# EasyEDA Pro project Boxi.eprj

# Schematic Light Controller
Board Name: Light Controller; Create Date: 2025-05-13; Page Name: P1; Project Name: Boxi; Schematic Name: Light Controller; Update Date: 2025-05-31; Company: Creme & Foxpaw; Page Size: A4; Version: V1.0
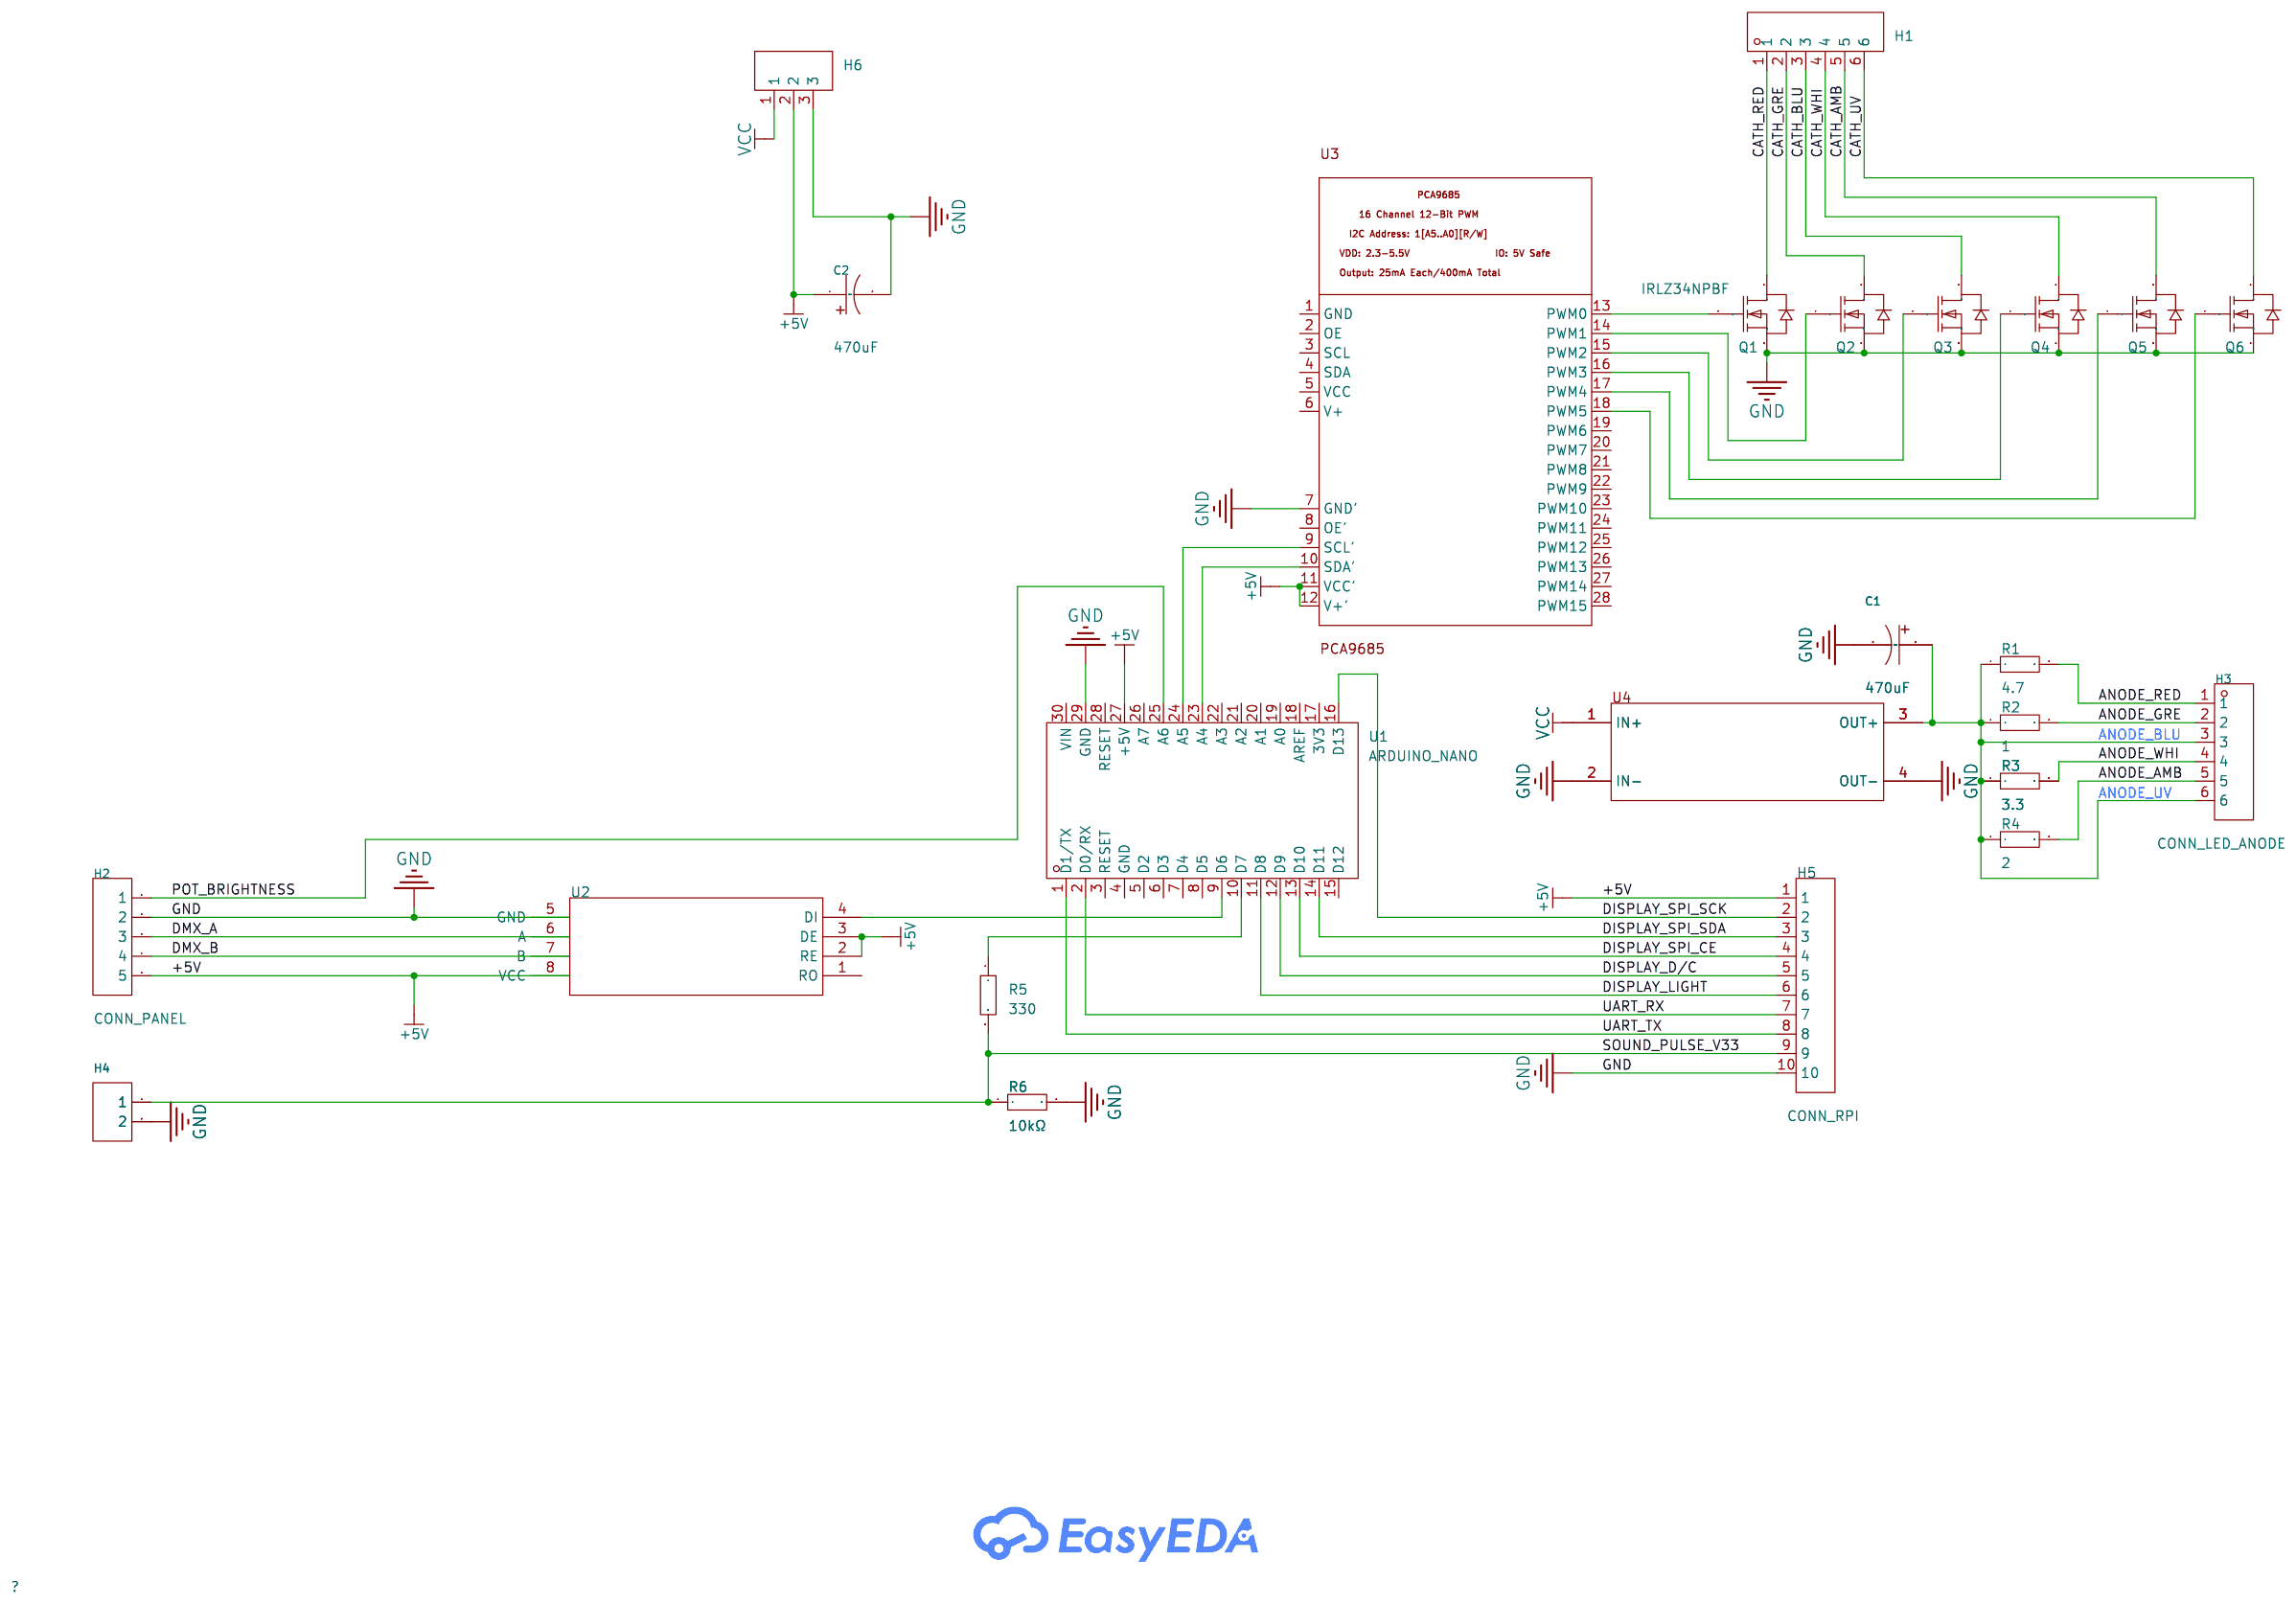
[diagram p0: schematic sheet]

## Parts
C1  470uF  [CAP-TH_BD13.0-P5.00-D0.6-FD]
C2  470uF  [CAP-TH_BD13.0-P5.00-D0.6-FD]
CONN_LED_CATHODE  H1  [HDR-TH_6P-P2.54-V-F]
H2  CONN_PANEL  [HDR-TH_5P-P2.54-V-F]
H3  CONN_LED_ANODE  [HDR-TH_6P-P2.54-V-F]
H4  -  [HDR-TH_2P-P2.54-V-F]
H5  CONN_RPI  [HDR-TH_10P-P2.54-V-F]
H6  -  [HDR-TH_3P-P2.54-V-F]
Q1  IRLZ34NPBF  [TO-220-3_L10.0-W4.5-P2.54-T]
Q2  IRLZ34NPBF  [TO-220-3_L10.0-W4.5-P2.54-T]
Q3  IRLZ34NPBF  [TO-220-3_L10.0-W4.5-P2.54-T]
Q4  IRLZ34NPBF  [TO-220-3_L10.0-W4.5-P2.54-T]
Q5  IRLZ34NPBF  [TO-220-3_L10.0-W4.5-P2.54-T]
Q6  IRLZ34NPBF  [TO-220-3_L10.0-W4.5-P2.54-T]
R1  4.7  [RES-TH_BD5.0-L15.5-P19.50-D0.8]
R2  1  [RES-TH_BD5.0-L15.5-P19.50-D0.8]
R3  3.3  [RES-TH_BD5.0-L15.5-P19.50-D0.8]
R4  2  [RES-TH_BD5.0-L15.5-P19.50-D0.8]
R5  330  [R_AXIAL-0.4]
R6  10kΩ  [R_AXIAL-0.4]
U1  ARDUINO_NANO  [COMM-TH_ARDUINO_NANO]
U2  -  [MAX485]
U5  -  [PCA9685 MINI]
U6  -  [BuckBoost]

## Library data of the parts
C1 C2 = TKR471M1JJ21M: LCSC Part Name: 470uF ±20% 63V; Supplier Part: C5137684; Manufacturer: JAMICON(凯美); Supplier Footprint: 插件,D13xL21mm; JLCPCB Part Class: Extended Part; Supplier: LCSC; Tolerance: ±20%
CONN_LED_CATHODE H3 = HDR-F_2.54_1x6P: Supplier Footprint: Through
H2 = HDR-F_2.54_1x5P: Supplier Footprint: Through
H4 = HDR-F_2.54_1x2P: Supplier Footprint: Through
H5 = HDR-F_2.54_1x10P: Supplier Footprint: Through
H6 = HDR-F_2.54_1x3P: Supplier Footprint: Through
Q1-Q6 = IRLZ34NPBF: LCSC Part Name: N沟道 耐压:55V 电流:30A; Supplier Part: C11728; Supplier Footprint: TO-220-3; JLCPCB Part Class: Extended Part; Supplier: LCSC; Drain Source On Resistance (RDS(on)@Vgs,Id): 35mΩ@10V,16A
R1-R4 = Res_AXIAL-3W: Supplier Footprint: Through
R5 R6 = Res_AXIAL-1/4W: Supplier Footprint: Through
U1 = ARDUINO_NANO: Supplier Part: C9900017879; Supplier Footprint: 插件; JLCPCB Part Class: Extended Part; Supplier: LCSC
U2 = MAX485 Board
U5 = PCA9685 MINI
U6 = BuckBoost

## Nets
+5V: C2.1 H2.5 H5.1 H6.2 U1.27(+5V) U2.2(RE) U2.3(DE) U2.8(VCC) U5.11(VCC') U5.12(V+')
GND: C1.2 C2.2 H2.2 H4.2 H5.10 H6.3 Q1.3(S) Q2.3(S) Q3.3(S) Q4.3(S) Q5.3(S) Q6.3(S) R6.2 U1.29(GND) U2.5(GND) U5.7(GND') U6.2(IN-) U6.4(OUT-)
VCC: H6.1 U6.1(IN+)
ANODE_AMB: H3.5 R4.2
ANODE_GRE: H3.2 R2.2
ANODE_RED: H3.1 R1.2
ANODE_WHI: H3.4 R3.2
CATH_AMB: CONN_LED_CATHODE.5 Q5.2(D)
CATH_BLU: CONN_LED_CATHODE.3 Q3.2(D)
CATH_GRE: CONN_LED_CATHODE.2 Q2.2(D)
CATH_RED: CONN_LED_CATHODE.1 Q1.2(D)
CATH_UV: CONN_LED_CATHODE.6 Q6.2(D)
CATH_WHI: CONN_LED_CATHODE.4 Q4.2(D)
DISPLAY_D/C: H5.5 U1.12(D9)
DISPLAY_LIGHT: H5.6 U1.11(D8)
DISPLAY_SPI_CE: H5.4 U1.13(D10)
DISPLAY_SPI_SCK: H5.2 U1.16(D13)
DISPLAY_SPI_SDA: H5.3 U1.14(D11)
DMX_A: H2.3 U2.6(A)
DMX_B: H2.4 U2.7(B)
POT_BRIGHTNESS: H2.1 U1.25(A6)
SOUND_PULSE_V33: H4.1 H5.9 R5.2 R6.1
UART_RX: H5.7 U1.2(D0/RX)
UART_TX: H5.8 U1.1(D1/TX)
$1N749: U1.23(A4) U5.10(SDA')
$1N754: U1.24(A5) U5.9(SCL')
$1N1179: R5.1 U1.10(D7)
$1N2604: Q2.1(G) U5.14(PWM1)
$1N2614: Q3.1(G) U5.15(PWM2)
$1N3870: C1.1 H3.3 H3.6 R1.1 R2.1 R3.1 R4.1 U6.3(OUT+)
$1N7627: U1.9(D6) U2.4(DI)
$1N9113: Q6.1(G) U5.18(PWM5)
$1N9120: Q5.1(G) U5.17(PWM4)
$1N9127: Q4.1(G) U5.16(PWM3)
$1N9131: Q1.1(G) U5.13(PWM0)

Not connected (* = marked no-connect by the designer): U1 3(RESET) 4(GND) 5(D2) 6(D3) 7(D4) 8(D5) 15(D12) 17(3V3) 18(AREF) 19(A0) 20(A1) 21(A2) 22(A3) 26(A7) 28(RESET) 30(VIN); U2 1(RO); U5 1(GND) 2(OE) 3(SCL) 4(SDA) 5(VCC) 6(V+) 8(OE') 19(PWM6) 20(PWM7) 21(PWM8) 22(PWM9) 23(PWM10) 24(PWM11) 25(PWM12) 26(PWM13) 27(PWM14) 28(PWM15)

## Notes on the sheet
- ANODE_BLU
- ANODE_UV

# Schematic Pi Hat
Board Name: Pi Hat; Create Date: 2025-05-13; Page Name: P1; Project Name: Boxi; Schematic Name: Pi Hat; Update Date: 2025-05-31; Company: Creme & Foxpaw; Page Size: A4; Version: V1.0
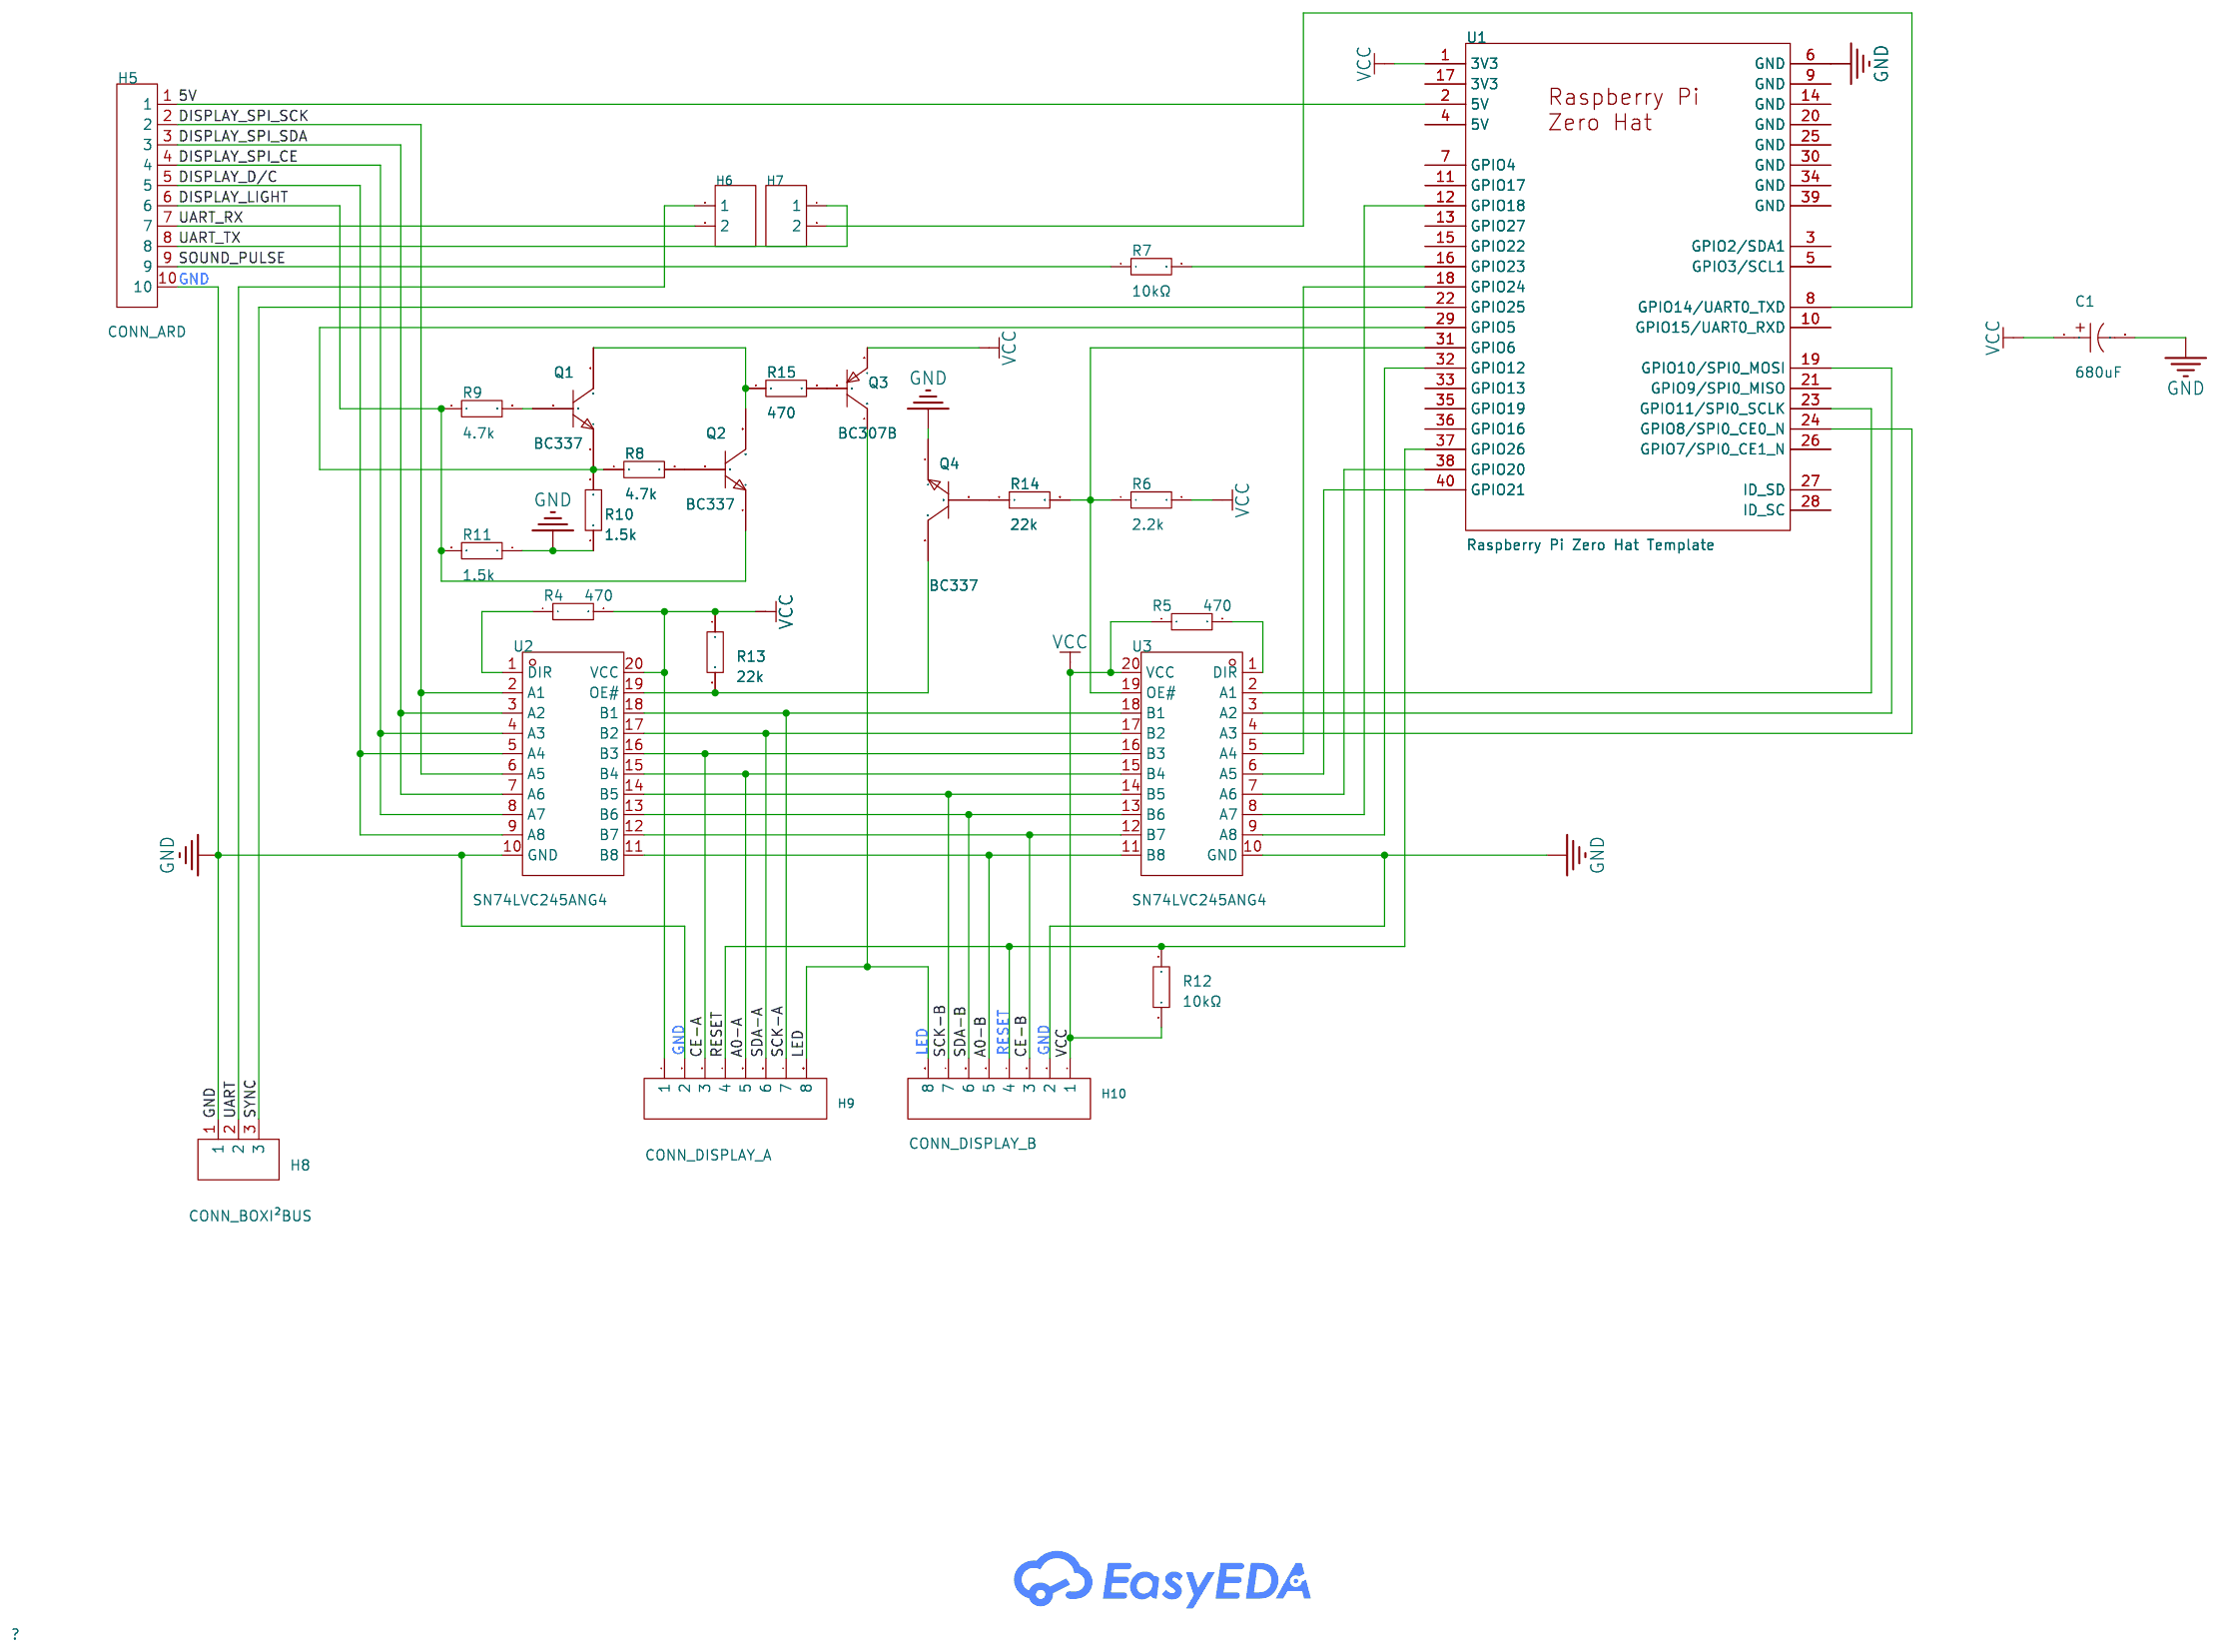
[diagram p1: schematic sheet]

## Parts
C1  680uF  [CAP-TH_BD8.0-P3.50-D0.6-FD_1]
H5  CONN_ARD  [HDR-TH_10P-P2.54-V-F]
H6  -  [HDR-TH_2P-P2.54-V-F]
H7  -  [HDR-TH_2P-P2.54-V-F]
H8  CONN_BOXI²BUS  [HDR-TH_3P-P2.54-V-F]
H9  CONN_DISPLAY_A  [HDR-TH_8P-P2.54-V-F-1]
H10  CONN_DISPLAY_B  [HDR-TH_8P-P2.54-V-F-1]
Q1  BC337  [TO-92-3_L4.8-W3.7-P2.54-R]
Q2  BC337  [TO-92-3_L4.8-W3.7-P2.54-R]
Q3  BC307B  [TO-92-3_L4.8-W3.7-P1.27-L-1]
Q4  BC337  [TO-92-3_L4.8-W3.7-P2.54-R]
R4  470  [R_AXIAL-0.4]
R5  470  [R_AXIAL-0.4]
R6  2.2k  [R_AXIAL-0.4]
R7  10kΩ  [R_AXIAL-0.4]
R8  4.7k  [R_AXIAL-0.4]
R9  4.7k  [R_AXIAL-0.4]
R10  1.5k  [R_AXIAL-0.4]
R11  1.5k  [R_AXIAL-0.4]
R12  10kΩ  [R_AXIAL-0.4]
R13  22k  [R_AXIAL-0.4]
R14  22k  [R_AXIAL-0.4]
R15  470  [R_AXIAL-0.4]
U1  Raspberry Pi Zero Hat Template  [RASPBERRY_PI_ZERO_HAT]
U2  SN74LVC245ANG4  [PDIP-20_L25.9-W6.6-P2.54-LS7.9-BL]
U3  SN74LVC245ANG4  [PDIP-20_L25.9-W6.6-P2.54-LS7.9-BL]

## Library data of the parts
C1 = ESK687M1EF16CB: LCSC Part Name: 680uF ±20% 25V; Supplier Part: C2691538; Manufacturer: MAN YUE(万裕科技); Supplier Footprint: 插件,D8xL16mm; JLCPCB Part Class: Extended Part; Datasheet: https://atta.szlcsc.com/upload/public/pdf/source/20190724/C406799_CDF11B2185D3B9C175922EABD678815E.pdf; Supplier: LCSC; Tolerance: ±20%; Voltage Rating: 25V; Pin Spacing: 3.5mm; Diameter: 8mm; Height - Seated (Max): 16mm; Lifetime: 9000hrs@105℃; Operating Temperature: -45℃~+105℃
H5 = HDR-F_2.54_1x10P: Supplier Footprint: Through
H6 H7 = HDR-F_2.54_1x2P: Supplier Footprint: Through
H8 = HDR-F_2.54_1x3P: Supplier Footprint: Through
H9 H10 = HDR-F_2.54_1x8P: Supplier Footprint: Through
Q1 Q2 Q4 = BC337: LCSC Part Name: 25(160-400); Supplier Part: C328602; Manufacturer: BLUE ROCKET(蓝箭); Supplier Footprint: TO-92-3; JLCPCB Part Class: Extended Part; Datasheet: https://atta.szlcsc.com/upload/public/pdf/source/20181114/C328602_2BE2B884E7C282175BCFE1345E8CDD23.pdf; Supplier: LCSC; type: NPN; Current - Collector(Ic): 800mA; Pd - Power Dissipation: 625mW; DC Current Gain: 100@100mA,1V; Transition frequency(fT): 100MHz; Current - Collector Cutoff: 100nA; Vce Saturation(VCE(sat)): 700mV
Q3 = BC307B: Supplier Part: C3201842; Manufacturer: onsemi(安森美); Supplier Footprint: TO-92-3; JLCPCB Part Class: Extended Part; Datasheet: https://atta.szlcsc.com/upload/public/pdf/source/20230915/AD93F1D629FAD82B19559B4DCC94CDC5.pdf; Supplier: LCSC; type: PNP; DC Current Gain: 180@2mA,5V; Transition frequency(fT): 130MHz; Current - Collector Cutoff: 15nA; Vce Saturation(VCE(sat)): 300mV@10mA,500uA
R4-R15 = Res_AXIAL-1/4W: Supplier Footprint: Through
U1 = Raspberry Pi Zero Hat Template: Manufacturer: Raspberry Pi Foundation
U2 U3 = SN74LVC245ANG4: Supplier Part: C1548982; Manufacturer: TI(德州仪器); Supplier Footprint: PDIP-20; JLCPCB Part Class: Extended Part; Datasheet: https://www.ti.com/cn/lit/gpn/sn74lvc245a; Supplier: LCSC

## Nets
5V: H5.1 U1.2(5V)
GND: C1.2 H5.10 H8.1 H9.2 H10.2 Q4.1(E) R10.1 R11.1 U1.6(GND) U2.10(GND) U3.10(GND)
VCC: C1.1 H9.1 H10.1 Q3.3(E) R4.2 R5.1 R6.2 R12.2 R13.1 U1.1(3V3) U2.20(VCC) U3.20(VCC)
A0-A: H9.5 U2.15(B4) U3.15(B4)
A0-B: H10.5 U2.11(B8) U3.11(B8)
CE-A: H9.3 U2.16(B3) U3.16(B3)
CE-B: H10.3 U2.12(B7) U3.12(B7)
DISPLAY_D/C: H5.5 U2.5(A4) U2.9(A8)
DISPLAY_LIGHT: H5.6 Q2.1(E) R9.1 R11.2
DISPLAY_SPI_CE: H5.4 U2.4(A3) U2.8(A7)
DISPLAY_SPI_SCK: H5.2 U2.2(A1) U2.6(A5)
DISPLAY_SPI_SDA: H5.3 U2.3(A2) U2.7(A6)
LED: H9.8 H10.8 Q3.1(C)
RESET: H9.4 H10.4 R12.1 U1.37(GPIO26)
SCK-A: H9.7 U2.18(B1) U3.18(B1)
SCK-B: H10.7 U2.14(B5) U3.14(B5)
SDA-A: H9.6 U2.17(B2) U3.17(B2)
SDA-B: H10.6 U2.13(B6) U3.13(B6)
SOUND_PULSE: H5.9 R7.1
SYNC: H8.3 U1.22(GPIO25)
UART: H6.1 H8.2
UART_RX: H5.7 H6.2
UART_TX: H5.8 H7.1
$1N1683: U1.23(GPIO11/SPI0_SCLK) U3.2(A1)
$1N1689: U1.19(GPIO10/SPI0_MOSI) U3.3(A2)
$1N1695: U1.24(GPIO8/SPI0_CE0_N) U3.4(A3)
$1N1701: U1.18(GPIO24) U3.5(A4)
$1N1733: U1.40(GPIO21) U3.6(A5)
$1N1755: U1.38(GPIO20) U3.7(A6)
$1N1761: U1.12(GPIO18) U3.8(A7)
$1N1789: U1.32(GPIO12) U3.9(A8)
$1N1944: R4.1 U2.1(DIR)
$1N1977: R5.2 U3.1(DIR)
$1N2168: R6.1 R14.2 U1.31(GPIO6) U3.19(OE#)
$1N2174: Q4.3(C) R13.2 U2.19(OE#)
$1N2477: H7.2 U1.8(GPIO14/UART0_TXD)
$1N2537: R7.2 U1.16(GPIO23)
$1N3217: Q1.3(C) Q2.3(C) R15.1
$1N3257: Q1.1(E) R8.1 R10.2 U1.29(GPIO5)
$1N3259: Q2.2(B) R8.2
$1N3309: Q1.2(B) R9.2
$1N5387: Q4.2(B) R14.1
$1N5983: Q3.2(B) R15.2

Not connected (* = marked no-connect by the designer): U1 3(GPIO2/SDA1) 4(5V) 5(GPIO3/SCL1) 7(GPIO4) 9(GND) 10(GPIO15/UART0_RXD) 11(GPIO17) 13(GPIO27) 14(GND) 15(GPIO22) 17(3V3) 20(GND) 21(GPIO9/SPI0_MISO) 25(GND) 26(GPIO7/SPI0_CE1_N) 27(ID_SD) 28(ID_SC) 30(GND) 33(GPIO13) 34(GND) 35(GPIO19) 36(GPIO16) 39(GND)

## Notes on the sheet
- GND
- GND
- LED
- RESET
- GND

# Schematic Audio Mixer
Board Name: Audio Mixer; Create Date: 2025-05-19; Page Name: P1; Project Name: Boxi; Schematic Name: Audio Mixer; Update Date: 2025-05-19; Company: Creme & Foxpaw; Page Size: A4; Version: V1.0
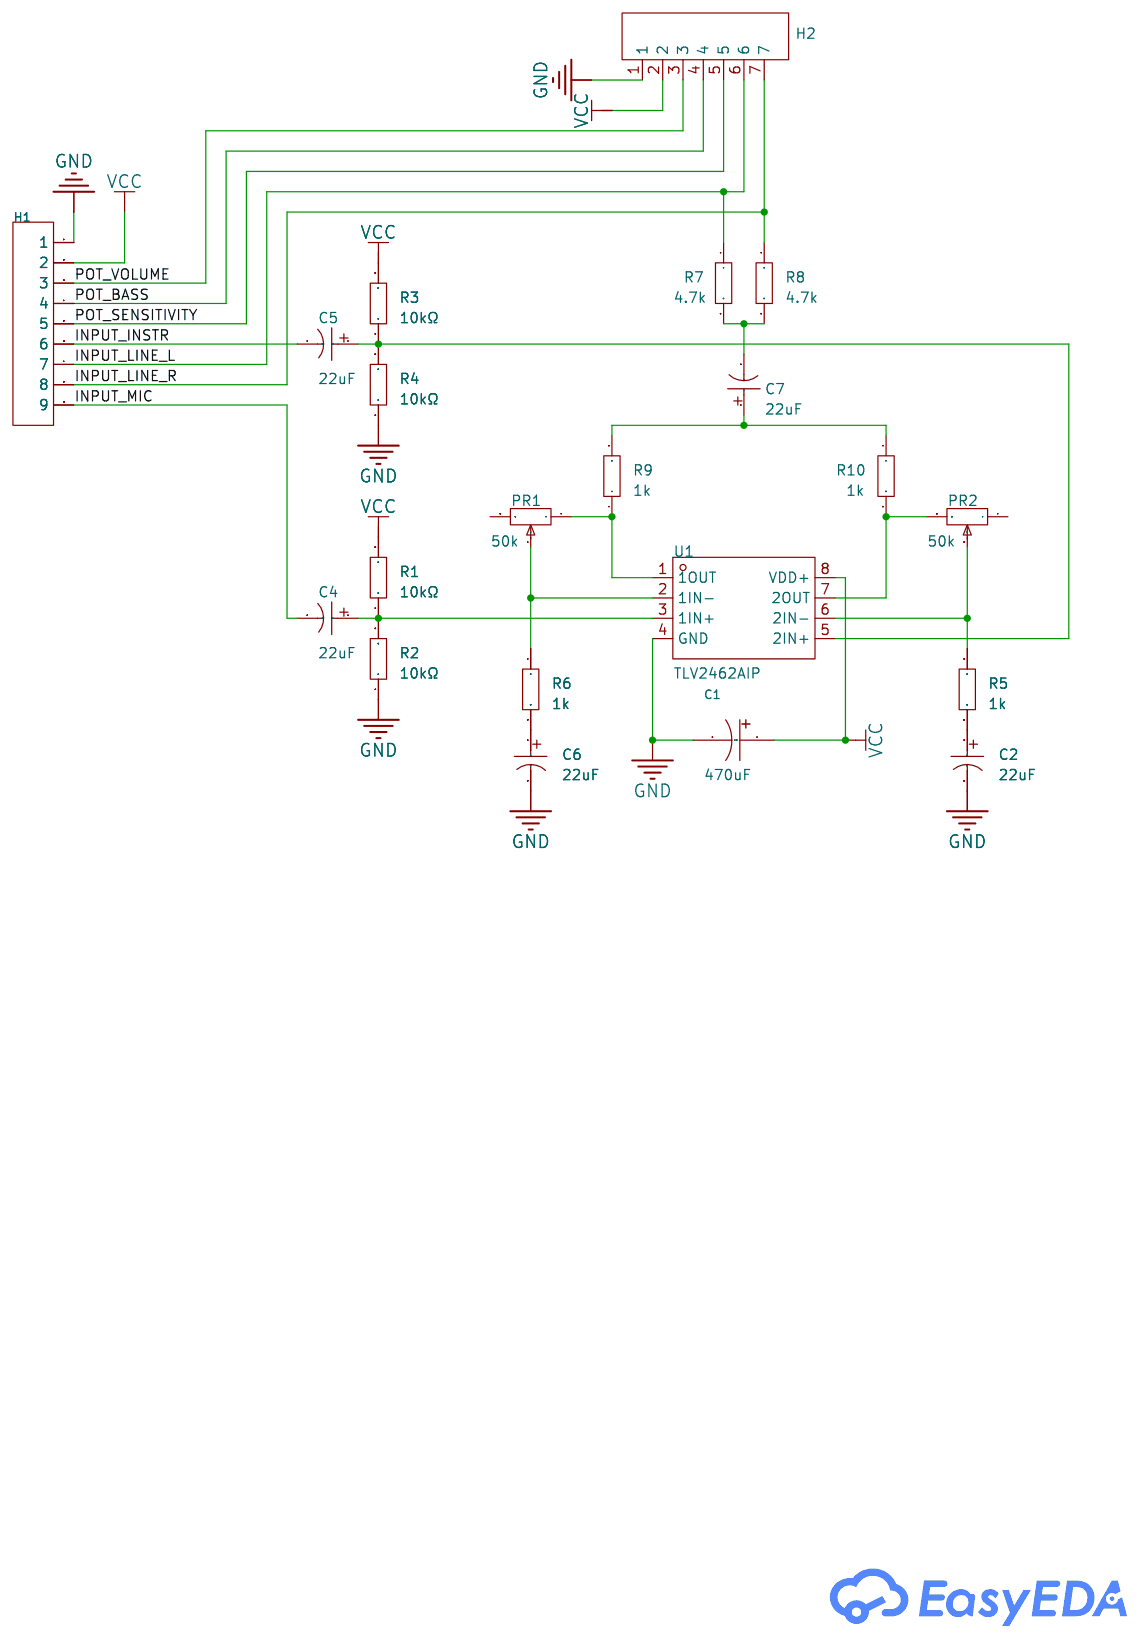
[diagram p2: schematic sheet]

## Parts
C1  470uF  [CAP-TH_BD13.0-P5.00-D0.6-FD]
C2  22uF  [CAP-TH_BD6.3-P2.50-D1.0-FD]
C4  22uF  [CAP-TH_BD6.3-P2.50-D1.0-FD]
C5  22uF  [CAP-TH_BD6.3-P2.50-D1.0-FD]
C6  22uF  [CAP-TH_BD6.3-P2.50-D1.0-FD]
C7  22uF  [CAP-TH_BD6.3-P2.50-D1.0-FD]
H1  -  [HDR-TH_9P-P2.54-V-F-1]
H2  -  [HDR-TH_7P-P2.54-V-F]
PR1  50k  [RES-ADJ-TH_3P-L10.0-W10.0-P2.50-L]
PR2  50k  [RES-ADJ-TH_3P-L10.0-W10.0-P2.50-L]
R1  10kΩ  [R_AXIAL-0.4]
R2  10kΩ  [R_AXIAL-0.4]
R3  10kΩ  [R_AXIAL-0.4]
R4  10kΩ  [R_AXIAL-0.4]
R5  1k  [R_AXIAL-0.4]
R6  1k  [R_AXIAL-0.4]
R7  4.7k  [R_AXIAL-0.4]
R8  4.7k  [R_AXIAL-0.4]
R9  1k  [R_AXIAL-0.4]
R10  1k  [R_AXIAL-0.4]
U1  TLV2462AIP  [PDIP-8_L9.6-W6.4-P2.54-LS7.9-BL]

## Library data of the parts
C1 = TKR471M1JJ21M: LCSC Part Name: 470uF ±20% 63V; Supplier Part: C5137684; Manufacturer: JAMICON(凯美); Supplier Footprint: 插件,D13xL21mm; JLCPCB Part Class: Extended Part; Supplier: LCSC; Tolerance: ±20%
C2 C4-C7 = 470uF 10V 6.3*7: LCSC Part Name: 470uF 10V; Supplier Part: C43325; Supplier Footprint: 插件,6.3x7mm; JLCPCB Part Class: Extended Part; Supplier: LCSC
H1 = HDR-F_2.54_1x9P: Supplier Footprint: Through
H2 = HDR-F_2.54_1x7P: Supplier Footprint: Through
PR1 PR2 = R_3296: Supplier Footprint: Through
R1-R10 = Res_AXIAL-1/4W: Supplier Footprint: Through
U1 = TLV2462AIP: Supplier Part: C1348187; Manufacturer: TI(德州仪器); Supplier Footprint: PDIP-8; JLCPCB Part Class: Extended Part; Datasheet: https://www.ti.com/cn/lit/gpn/tlv2464; Supplier: LCSC; Number of Circuits: Dual; Gain Bandwidth Product(GBP): 6.4MHz; Slew Rate(SR): 1.6V/us; Current - Input Bias(Ib): 1.3nA; Output Current: 80mA; Operating Temperature: -40℃~+125℃

## Nets
GND: C1.2 C2.2 C6.2 H1.1 H2.1 R2.1 R4.1 U1.4(GND)
VCC: C1.1 H1.2 H2.2 R1.2 R3.2 U1.8(VDD+)
INPUT_INSTR: C5.2 H1.6
INPUT_LINE_L: H1.7 H2.6 R7.1
INPUT_LINE_R: H1.8 H2.7 R8.1
INPUT_MIC: C4.2 H1.9
POT_BASS: H1.4 H2.4
POT_SENSITIVITY: H1.5 H2.5
POT_VOLUME: H1.3 H2.3
$1N770: C4.1 R1.1 R2.2 U1.3(1IN+)
$1N1061: PR2.3 R10.2 U1.7(2OUT)
$1N1293: C5.1 R3.1 R4.2 U1.5(2IN+)
$1N1394: C2.1 R5.2
$1N1446: C6.1 R6.2
$1N1450: PR1.2 R6.1 U1.2(1IN-)
$1N1454: PR2.2 R5.1 U1.6(2IN-)
$1N1584: PR1.1 R9.1 U1.1(1OUT)
$1N2116: C7.2 R7.2 R8.2
$1N2130: C7.1 R9.2 R10.1

Not connected (* = marked no-connect by the designer): PR1 3; PR2 1

# Board Light Controller
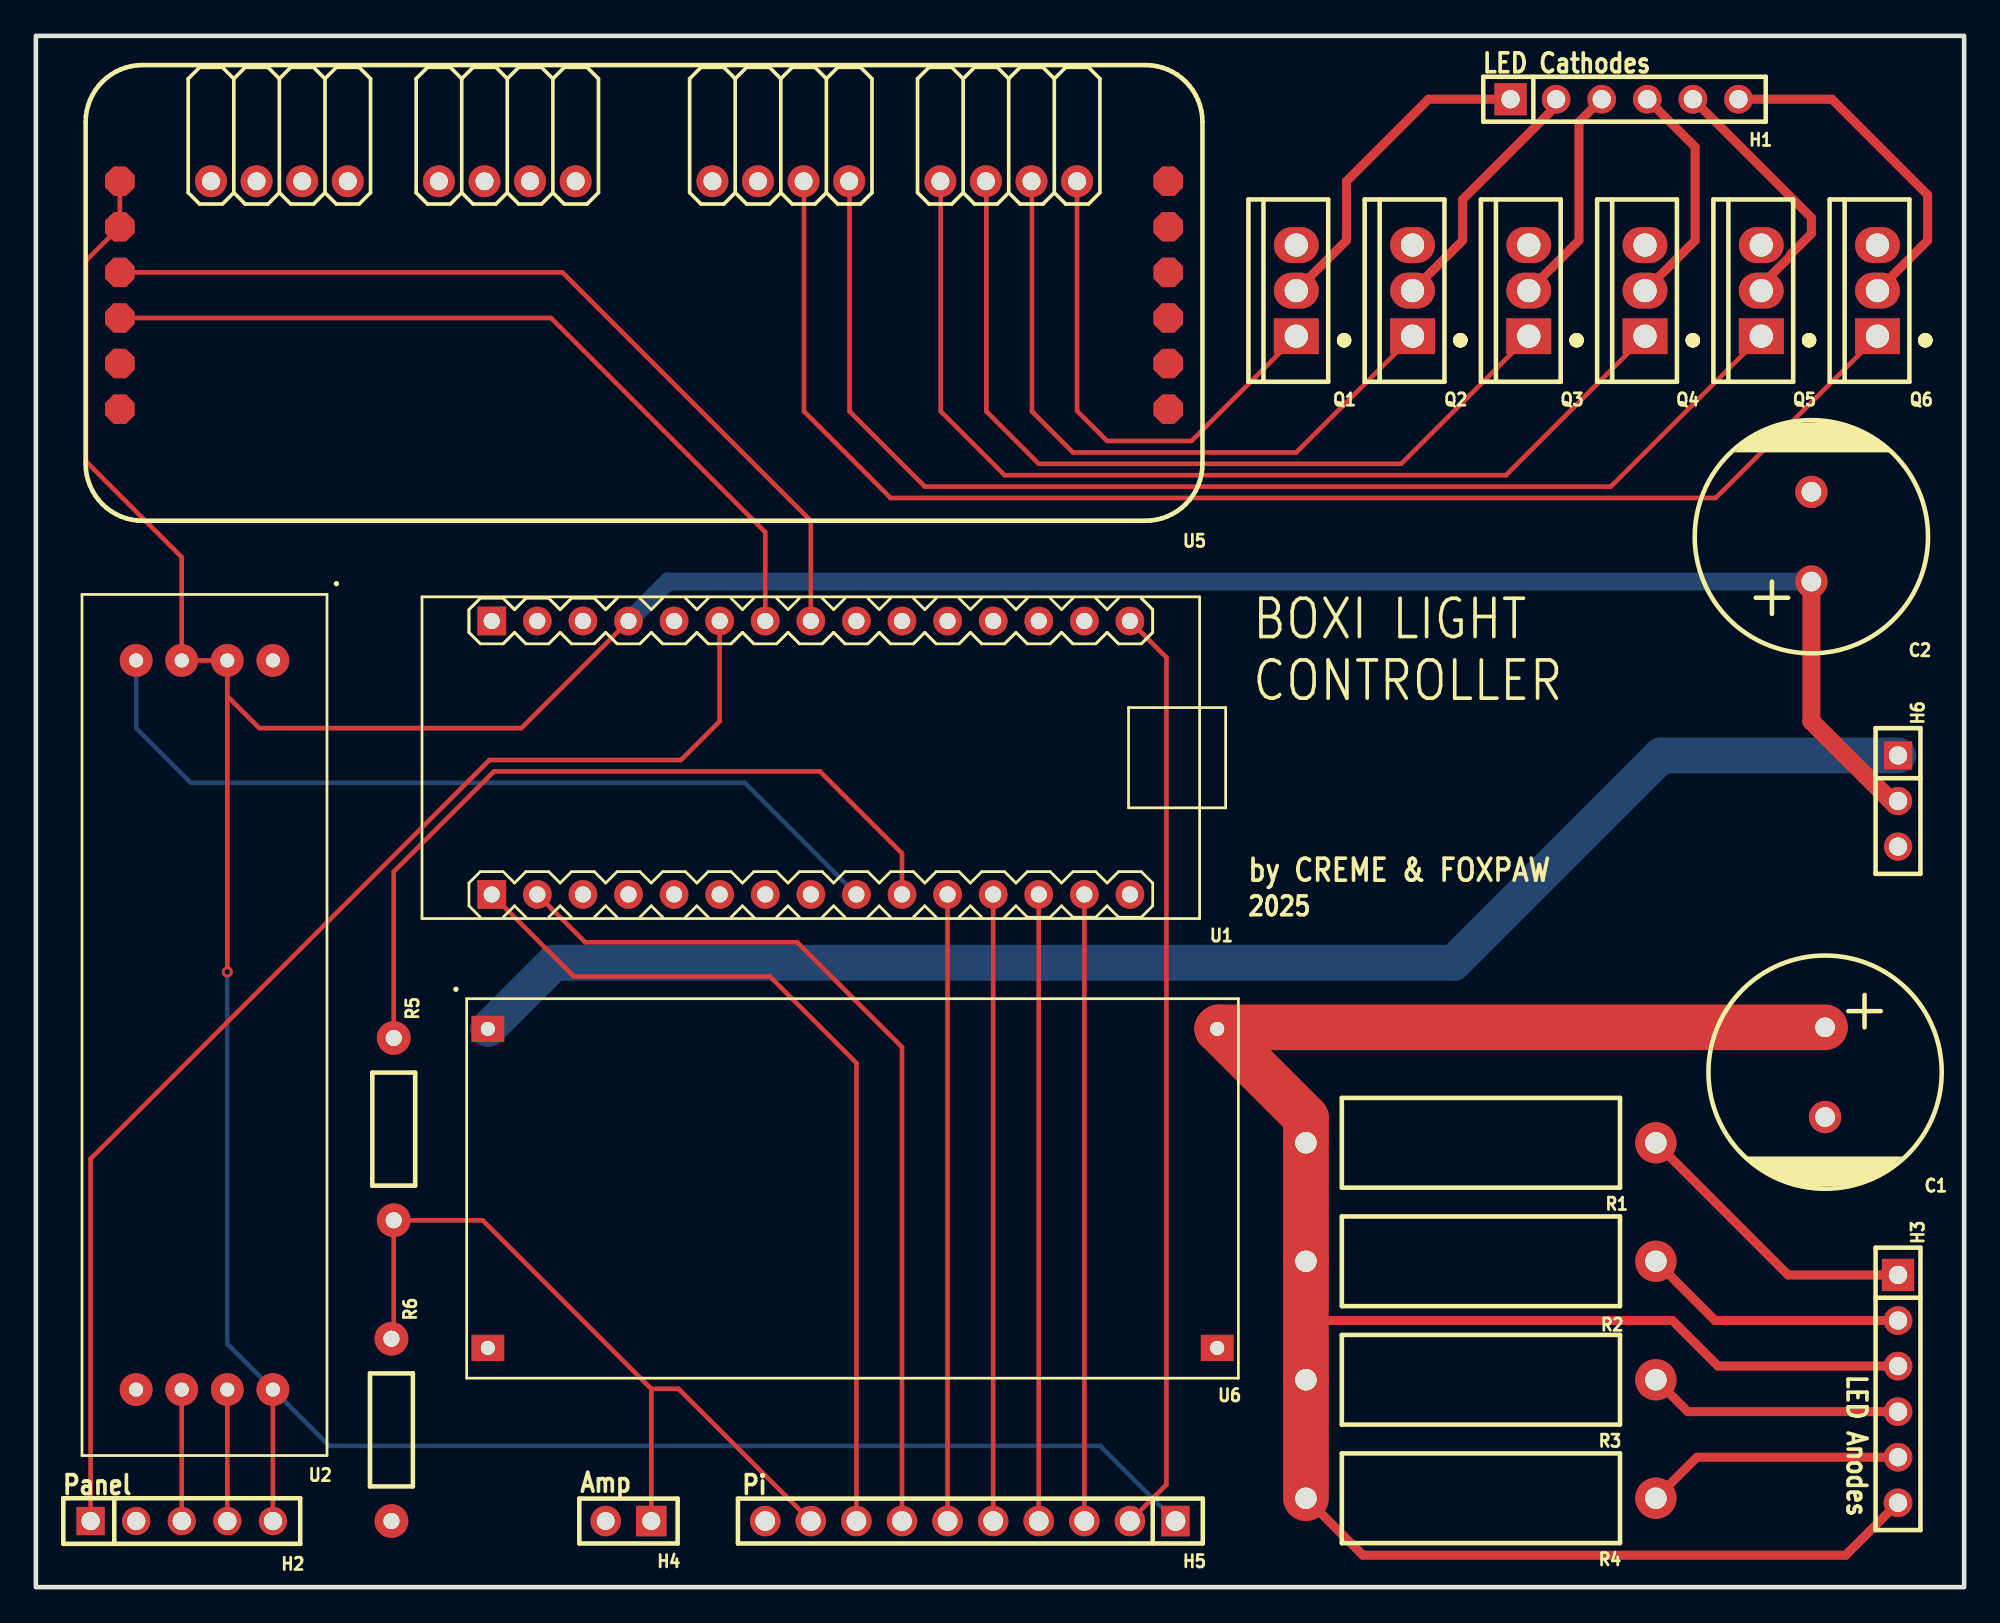
[diagram p3: board, top side]
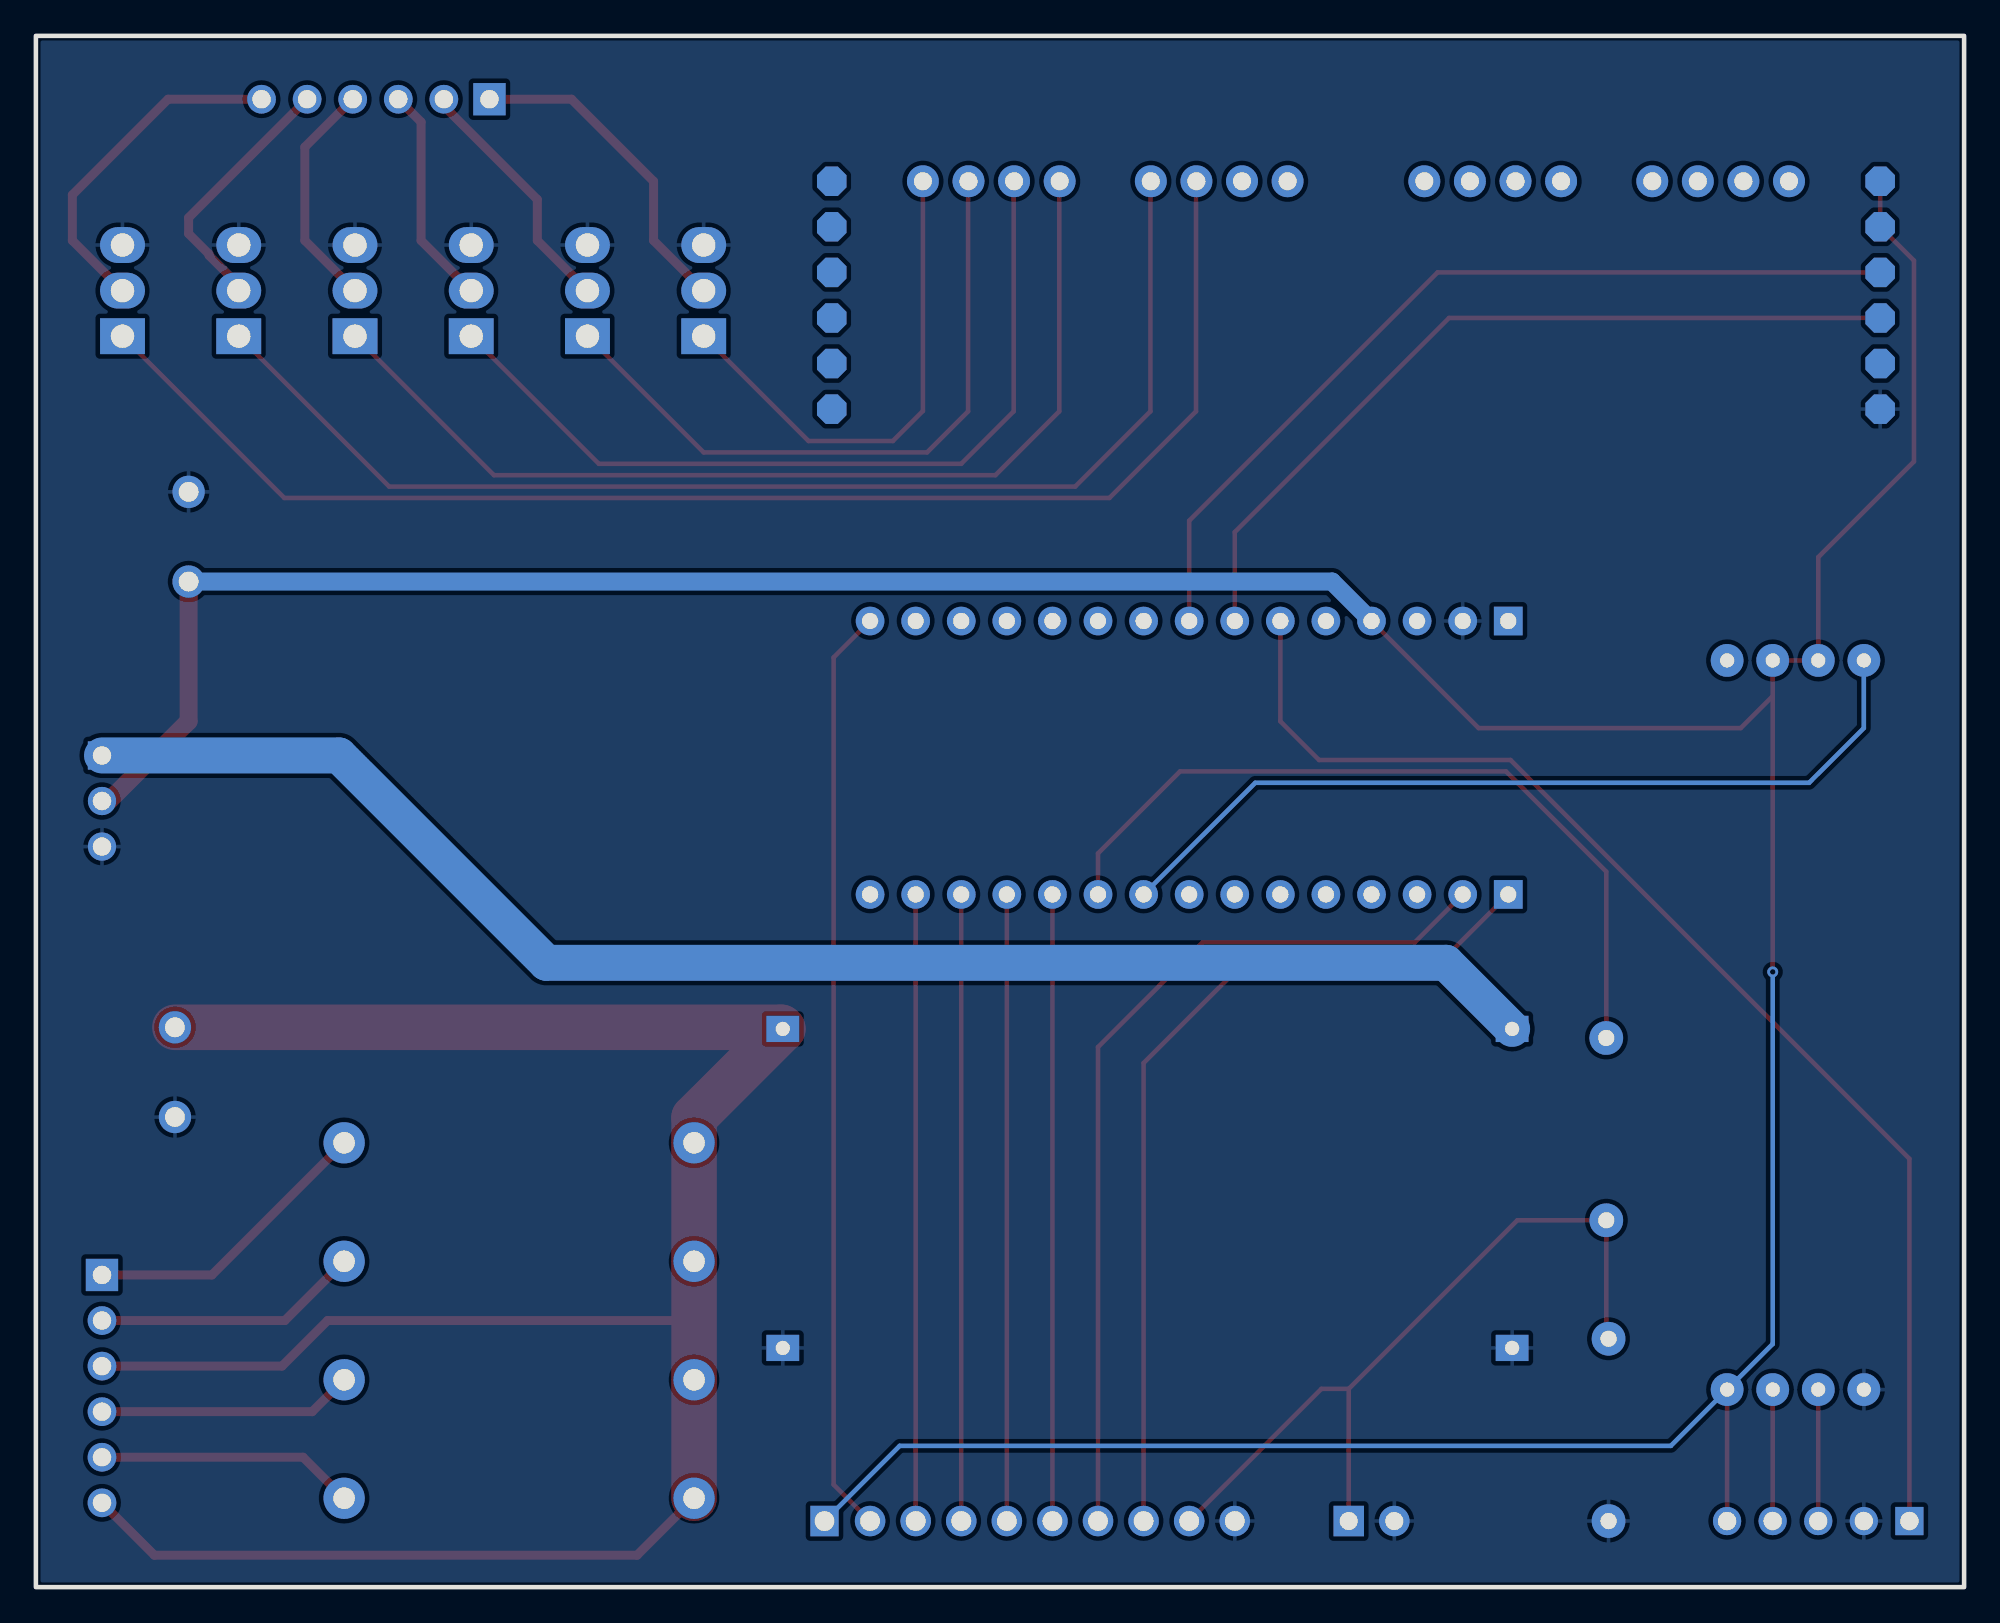
[diagram p4: board, bottom side, seen from below]

Outline 107.44 x 86.46 mm; copper layers: Top Layer, Bottom Layer. Coordinates in mm from the lower left corner of the outline.
Outline path: rectangle 0,86.46 107.44,0
Stack: Top Layer 0.035mm / Dielectric1 1.51mm FR4 er 4.5 / Bottom Layer 0.035mm

## Design rules (mm)
template: JLCPCB Capability(Two Layers Board)
spacing copperThickness1oz (default): track to track 0.102, other pairs 0.152 to 0.3
spacing copperThickness2oz: track to track 0.203, other pairs 0.152 to 0.3
track width copperThickness1oz (default): min 0.127, default 0.254, max 2.54
track width copperThickness2oz: min 0.203, default 0.254, max 2.54
differential pair differentialPair (default): width min 0.127, default 0.254, max 2.54; gap min 0.152, default 0.152
via viaSize (default): diameter min 0.5, default 0.61, max 10; hole min 0.3, default 0.305, max 6.3

## Placement (name value [footprint] x y rotation side)
C1  470uF  [CAP-TH_BD13.0-P5.00-D0.6-FD]  99.7 28.7 270 top
C2  470uF  [CAP-TH_BD13.0-P5.00-D0.6-FD]  98.93 58.55 90 top
H1  H1  [HDR-TH_6P-P2.54-V-F]  88.52 82.93 0 top
H2  CONN_PANEL  [HDR-TH_5P-P2.54-V-F]  8.13 3.68 0 top
H3  CONN_LED_ANODE  [HDR-TH_6P-P2.54-V-F]  103.76 11.05 270 top
H4  -  [HDR-TH_2P-P2.54-V-F]  33.02 3.68 180 top
H5  CONN_RPI  [HDR-TH_10P-P2.54-V-F]  52.07 3.68 180 top
H6  -  [HDR-TH_3P-P2.54-V-F]  103.76 43.81 270 top
Q1  IRLZ34NPBF  [TO-220-3_L10.0-W4.5-P2.54-T]  70.23 72.26 180 top
Q2  IRLZ34NPBF  [TO-220-3_L10.0-W4.5-P2.54-T]  76.71 72.26 180 top
Q3  IRLZ34NPBF  [TO-220-3_L10.0-W4.5-P2.54-T]  83.19 72.26 180 top
Q4  IRLZ34NPBF  [TO-220-3_L10.0-W4.5-P2.54-T]  89.66 72.26 180 top
Q5  IRLZ34NPBF  [TO-220-3_L10.0-W4.5-P2.54-T]  96.14 72.26 180 top
Q6  IRLZ34NPBF  [TO-220-3_L10.0-W4.5-P2.54-T]  102.62 72.26 180 top
R1  4.7  [RES-TH_BD5.0-L15.5-P19.50-D0.8]  80.52 24.77 0 top
R2  1  [RES-TH_BD5.0-L15.5-P19.50-D0.8]  80.52 18.16 0 top
R3  3.3  [RES-TH_BD5.0-L15.5-P19.50-D0.8]  80.52 11.56 0 top
R4  2  [RES-TH_BD5.0-L15.5-P19.50-D0.8]  80.52 4.95 0 top
R5  330  [R_AXIAL-0.4]  19.94 25.53 270 top
R6  10kΩ  [R_AXIAL-0.4]  19.81 8.76 270 top
U1  ARDUINO_NANO  [COMM-TH_ARDUINO_NANO]  43.18 46.23 180 top
U2  -  [MAX485]  10.03 31.37 270 top
U5  -  [PCA9685 MINI]  33.78 71.88 180 top
U6  -  [BuckBoost]  45.47 22.86 0 top

## Footprints (pads in the part's own frame, mm; a bottom-side part is the same pattern mirrored in y, then rotated)
BuckBoost
  rect 1.827x1.462 hole 0.787: 1(-20.282,8.252) 2(-20.282,-9.528) 3(20.358,8.252) 4(20.358,-9.528)
CAP-TH_BD13.0-P5.00-D0.6-FD
  round 1.8 hole 1.1: 1(-2.5,0) 2(2.5,0)
COMM-TH_ARDUINO_NANO
  rect 1.6x1.6 hole 0.9: 1(17.78,7.62) 30(17.78,-7.62)
  round 1.6 hole 0.9: 2(15.24,7.62) 3(12.7,7.62) 4(10.16,7.62) 5(7.62,7.62) 6(5.08,7.62) 7(2.54,7.62) 8(0,7.62) 9(-2.54,7.62) 10(-5.08,7.62) 11(-7.62,7.62) 12(-10.16,7.62) 13(-12.7,7.62) 14(-15.24,7.62) 15(-17.78,7.62) 16(-17.78,-7.62) 17(-15.24,-7.62) 18(-12.7,-7.62) 19(-10.16,-7.62) 20(-7.62,-7.62) 21(-5.08,-7.62) 22(-2.54,-7.62) 23(0,-7.62) 24(2.54,-7.62) 25(5.08,-7.62) 26(7.62,-7.62) 27(10.16,-7.62) 28(12.7,-7.62) 29(15.24,-7.62)
HDR-TH_2P-P2.54-V-F
  rect 1.7x1.7 hole 1: 1(-1.27,0)
  round 1.7 hole 1: 2(1.27,0)
HDR-TH_3P-P2.54-V-F
  rect 1.575x1.575 hole 1.02: 1(-2.54,0)
  round 1.575 hole 1.02: 2(0,0) 3(2.54,0)
HDR-TH_5P-P2.54-V-F
  rect 1.575x1.575 hole 1.02: 1(-5.08,0)
  round 1.575 hole 1.02: 2(-2.54,0) 3(0,0) 4(2.54,0) 5(5.08,0)
HDR-TH_6P-P2.54-V-F
  rect 1.8x1.8 hole 1.02: 1(-6.35,0)
  round 1.6 hole 1.02: 2(-3.81,0) 3(-1.27,0) 4(1.27,0) 5(3.81,0) 6(6.35,0)
HDR-TH_10P-P2.54-V-F
  rect 1.575x1.7 hole 1.1: 1(-11.43,0)
  round 1.7 hole 1.1: 2(-8.89,0) 3(-6.35,0) 4(-3.81,0) 5(-1.27,0) 6(1.27,0) 7(3.81,0) 8(6.35,0) 9(8.89,0) 10(11.43,0)
MAX485
  round 1.827 hole 0.787: 1(-20.282,3.172) 2(-20.282,0.632) 3(-20.282,-1.908) 4(-20.282,-4.448) 5(20.358,-4.448) 6(20.358,-1.908) 7(20.358,0.632) 8(20.358,3.172)
PCA9685 MINI
  custom 1.643x1.643 hole 1.021x1.016: 1(-29.315,6.223) 2(-29.315,3.683) 3(-29.315,1.143) 4(-29.315,-1.397) 5(-29.315,-3.937) 6(-29.315,-6.477) 7(29.105,6.223) 8(29.105,3.683)
  custom 1.643x1.643 hole 1.016x1.021: 9(29.105,1.143) 10(29.105,-1.397) 11(29.105,-3.937) 12(29.105,-6.477)
  round 1.778 hole 1x1: 13(-24.235,-6.477) 14(-21.695,-6.477) 15(-19.155,-6.477) 16(-16.615,-6.477) 17(-11.535,-6.477) 18(-8.995,-6.477) 19(-6.455,-6.477) 20(-3.915,-6.477) 21(3.705,-6.477) 22(6.245,-6.477) 23(8.785,-6.477) 24(11.325,-6.477) 25(16.405,-6.477) 26(18.945,-6.477) 27(21.485,-6.477) 28(24.025,-6.477)
R_AXIAL-0.4
  round 1.879 hole 0.899: 1(-5.08,0) 2(5.08,0)
RES-TH_BD5.0-L15.5-P19.50-D0.8
  round 2.3 hole 1.2: 1(-9.75,0) 2(9.75,0)
TO-220-3_L10.0-W4.5-P2.54-T
  rect 2.5x2 hole 1.3: 1(0,2.54)
  oval 2.5x2 hole 1.3: 2(0,0) 3(0,-2.54)

## Nets
As in the schematic, except:
CATH_AMB: H1.5 Q5.2
CATH_BLU: H1.3 Q3.2
CATH_GRE: H1.2 Q2.2
CATH_RED: H1.1 Q1.2
CATH_UV: H1.6 Q6.2
CATH_WHI: H1.4 Q4.2

Pads without a net: U1 3 4 5 6 7 8 15 17 18 19 20 21 22 26 28 30; U2 1; U5 1 2 3 4 5 6 8 19 20 21 22 23 24 25 26 27 28

## Via types
v1: diameter 0.61, hole 0.305, Top Layer to Bottom Layer, 1 via

## Routing (per net, layer and track width the routed paths; a pad name or vN(x,y) marks a point on that pad's centre or on a via; arc(x,y) is an arc through that point)
+5V: length 241.4
  Top Layer w0.254: 10.67,49.66 U2.2 U2.3 8.12,57.41 2.79,62.74 2.79,73.94 U5.11 4.68,78.36 ; 10.67,49.66 v1(10.67,34.29) ; 10.67,49.66 12.45,47.88 27.05,47.88 U1.27 ; U2.8 13.21,11.01 H2.5
  Top Layer w1: H6.2 103.38,43.81 98.93,48.26 C2.1
  Bottom Layer w0.254: H5.1 59.31,7.87 16.34,7.87 U2.8 10.67,13.55 v1(10.67,34.29)
  Bottom Layer w1: U1.27 35.22,56.05 C2.1
VCC: length 84.9
  Bottom Layer w2: U6.1 28.87,34.8 78.99,34.8 90.55,46.36 H6.1
ANODE_AMB: length 14.4
  Top Layer w0.5: H3.5 92.55,7.24 R4.2
ANODE_GRE: length 14.9
  Top Layer w0.5: R2.2 93.57,14.86 H3.2
ANODE_RED: length 16.5
  Top Layer w0.5: R1.2 97.63,17.4 H3.1
ANODE_WHI: length 14.2
  Top Layer w0.5: R3.2 92.05,9.78 H3.4
CATH_AMB: length 14.6
  Top Layer w0.5: H1.5 98.93,76.33 98.93,75.44 97.79,74.3 97.79,74.22 96.14,72.57 Q5.2
CATH_BLU: length 12.4
  Top Layer w0.5: Q3.2 85.98,75.06 85.98,81.66 H1.3
CATH_GRE: length 14
  Top Layer w0.5: H1.2 84.71,82.55 79.5,77.34 79.5,75.06 Q2.2
CATH_RED: length 18.3
  Top Layer w0.5: H1.1 77.6,82.93 73.02,78.36 73.02,75.06 Q1.2
CATH_UV: length 19.2
  Top Layer w0.5: H1.6 100.08,82.93 105.41,77.6 105.41,75.06 Q6.2
CATH_WHI: length 12.9
  Top Layer w0.5: H1.4 92.46,80.26 92.46,75.06 Q4.2
DISPLAY_D/C: length 34.9
  Top Layer w0.254: U1.12 H5.5
DISPLAY_LIGHT: length 34.9
  Top Layer w0.254: U1.11 H5.6
DISPLAY_SPI_CE: length 34.9
  Top Layer w0.254: 55.88,38.61 H5.4
DISPLAY_SPI_SCK: length 51.8
  Top Layer w0.254: U1.16 62.99,51.82 62.99,5.72 H5.2
DISPLAY_SPI_SDA: length 34.9
  Top Layer w0.254: U1.14 H5.3
DMX_A: length 7.3
  Top Layer w0.254: U2.6 8.13,11.01 H2.3
DMX_B: length 7.3
  Top Layer w0.254: H2.4 10.67,3.69 U2.7
POT_BRIGHTNESS: length 70.9
  Top Layer w0.254: 38.1,53.85 38.1,48.26 35.94,46.1 25.27,46.1 3.05,23.88 H2.1
SOUND_PULSE_V33: length 44.2
  Top Layer w0.254: H5.9 35.81,11.05 34.29,11.05 ; 34.29,11.05 24.89,20.45 R5.2 19.94,13.97 19.81,13.84 ; 34.29,11.05 H4.1
UART_RX: length 50.3
  Top Layer w0.254: U1.2 30.61,35.94 42.42,35.94 48.26,30.1 H5.7
UART_TX: length 49.7
  Top Layer w0.254: 25.4,38.61 29.97,34.04 40.89,34.04 45.72,29.21 H5.8
$1N749: length 49.8
  Top Layer w0.254: 4.68,73.28 29.34,73.28 43.18,59.44 U1.23
$1N754: length 45.9
  Top Layer w0.254: U5.9 28.7,70.74 40.64,58.8 U1.24
$1N1179: length 44.1
  Top Layer w0.254: R5.1 19.94,39.88 25.53,45.47 43.69,45.47 48.26,40.89 U1.10
$1N2604: length 37.7
  Top Layer w0.254: Q2.1 70.23,63.25 57.79,63.25 55.5,65.53 55.5,78.34 55.48,78.36
$1N2614: length 47.2
  Top Layer w0.254: Q3.1 76.07,62.61 55.88,62.61 52.96,65.53 52.96,78.34 52.94,78.36
$1N3870: length 130.8
  Top Layer w0.5: H3.6 100.84,1.78 73.94,1.78 R4.1 ; 71.63,14.86 91.19,14.86 93.73,12.32 103.76,12.32
  Top Layer w2.54: R4.1 R3.1 R2.1 R1.1 70.77,26.17 U6.3 65.91,31.2 C1.1
$1N7627: length 47.7
  Bottom Layer w0.254: 45.72,38.61 39.5,44.83 8.64,44.83 5.59,47.88 5.59,51.65 U2.4
$1N9113: length 78.4
  Top Layer w0.254: 42.78,78.36 42.8,78.34 42.8,65.53 47.63,60.71 93.6,60.71 Q6.1
$1N9120: length 68.8
  Top Layer w0.254: 45.32,78.36 45.34,78.34 45.34,65.53 49.53,61.34 87.76,61.34 Q5.1
$1N9127: length 56.8
  Top Layer w0.254: 50.4,78.36 50.42,78.34 50.42,65.53 53.98,61.98 81.92,61.98 Q4.1
$1N9131: length 28.1
  Top Layer w0.254: Q1.1 64.39,63.88 59.69,63.88 58.02,65.55 58.02,78.36

## Copper pours and planes (outline as drawn; the poured copper is in the pictures)
GND on Bottom Layer: -4.19,89.03 113.54,89.03 113.54,-4.32 -4.19,-4.32

## Text on the board
Top Silkscreen Layer: LED Anodes | Panel | Amp | Pi | 2025 | LED Cathodes | by CREME & FOXPAW | BOXI LIGHT / CONTROLLER

# Board Pi Hat
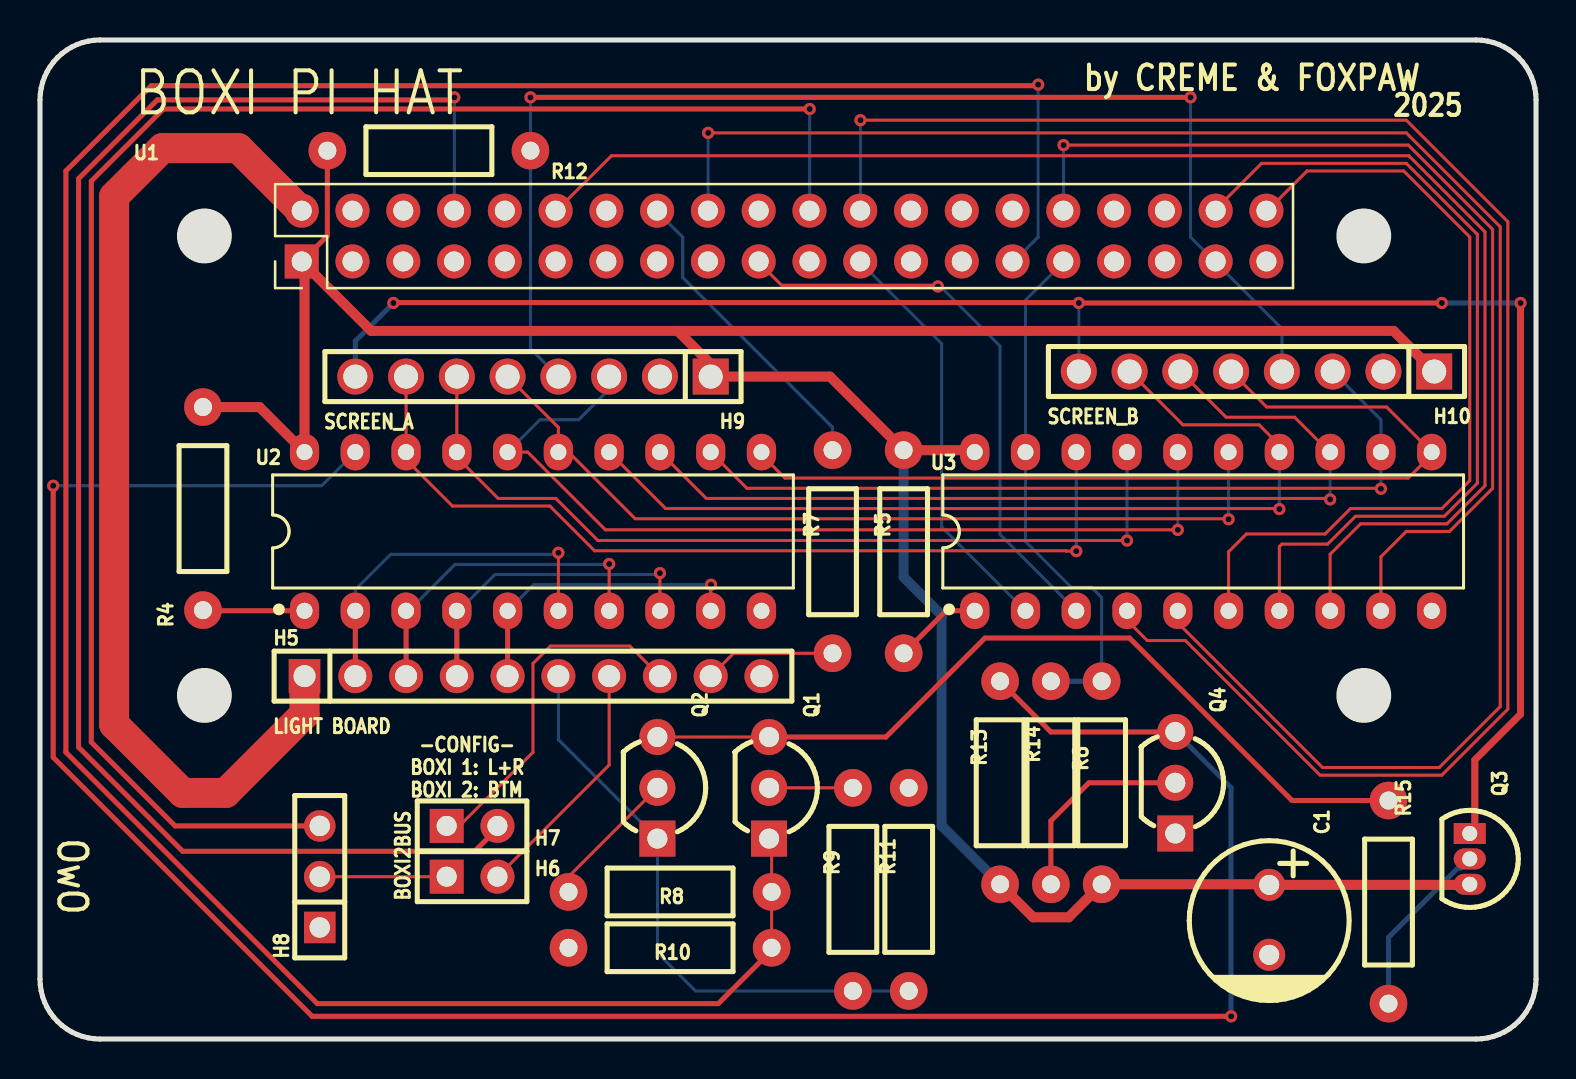
[diagram p5: board, top side]
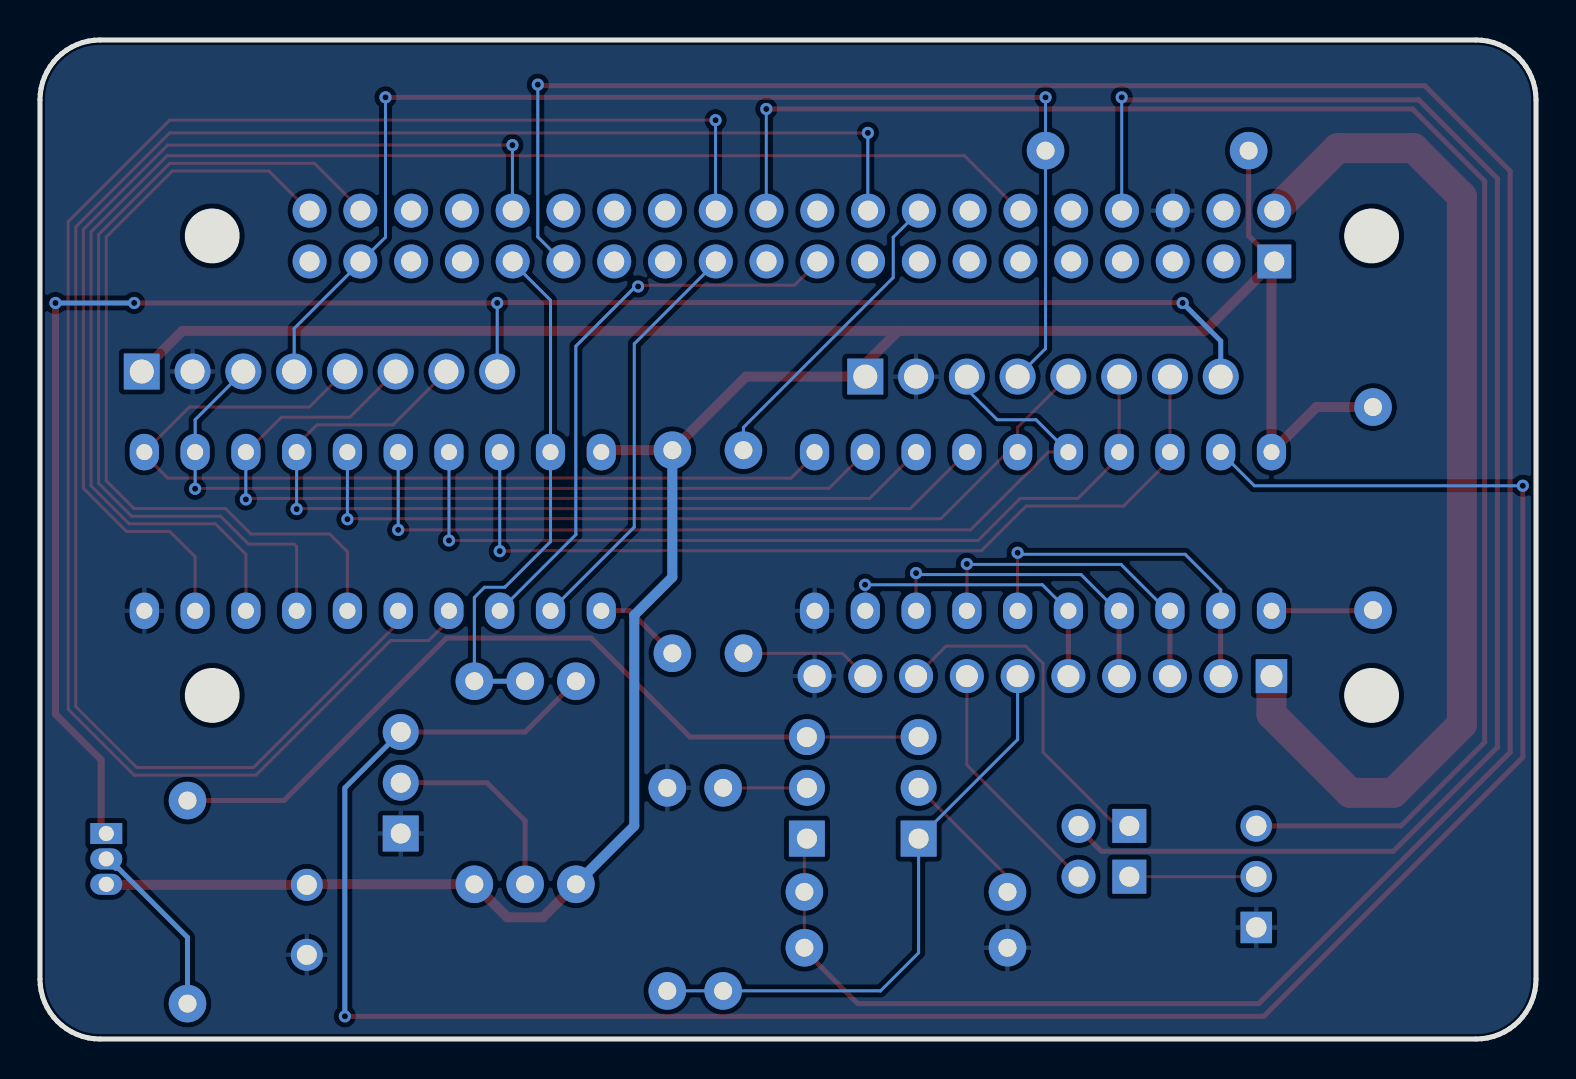
[diagram p6: board, bottom side, seen from below]

Outline 74.84 x 49.98 mm; copper layers: Top Layer, Bottom Layer. Coordinates in mm from the lower left corner of the outline.
Stack: Top Layer 0.035mm / Dielectric1 1.51mm FR4 er 4.5 / Bottom Layer 0.035mm

## Design rules (mm)
template: JLCPCB Capability(Two Layers Board)
spacing copperThickness1oz (default): track to track 0.102, other pairs 0.152 to 0.3
spacing copperThickness2oz: track to track 0.203, other pairs 0.152 to 0.3
track width copperThickness1oz (default): min 0.127, default 0.254, max 2.54
track width copperThickness2oz: min 0.203, default 0.254, max 2.54
differential pair differentialPair (default): width min 0.127, default 0.254, max 2.54; gap min 0.152, default 0.152
via viaSize (default): diameter min 0.5, default 0.61, max 10; hole min 0.3, default 0.305, max 6.3

## Placement (name value [footprint] x y rotation side)
C1  680uF  [CAP-TH_BD8.0-P3.50-D0.6-FD_1]  61.49 5.96 270 top
H5  CONN_ARD  [HDR-TH_10P-P2.54-V-F]  24.66 18.16 0 top
H6  -  [HDR-TH_2P-P2.54-V-F]  21.62 8.12 0 top
H7  -  [HDR-TH_2P-P2.54-V-F]  21.62 10.66 0 top
H8  CONN_BOXI²BUS  [HDR-TH_3P-P2.54-V-F]  14 8.12 90 top
H9  CONN_DISPLAY_A  [HDR-TH_8P-P2.54-V-F-1]  24.66 33.14 180 top
H10  CONN_DISPLAY_B  [HDR-TH_8P-P2.54-V-F-1]  60.86 33.39 180 top
Q1  BC337  [TO-92-3_L4.8-W3.7-P2.54-R]  36.47 12.57 270 top
Q2  BC337  [TO-92-3_L4.8-W3.7-P2.54-R]  30.89 12.57 270 top
Q3  BC307B  [TO-92-3_L4.8-W3.7-P1.27-L-1]  71.53 9.01 270 top
Q4  BC337  [TO-92-3_L4.8-W3.7-P2.54-R]  56.79 12.82 270 top
R4  470  [R_AXIAL-0.4]  8.15 26.54 90 top
R5  470  [R_AXIAL-0.4]  43.21 24.38 270 top
R6  2.2k  [R_AXIAL-0.4]  53.11 12.82 270 top
R7  10kΩ  [R_AXIAL-0.4]  39.65 24.38 90 top
R8  4.7k  [R_AXIAL-0.4]  31.52 7.36 180 top
R9  4.7k  [R_AXIAL-0.4]  40.67 7.49 90 top
R10  1.5k  [R_AXIAL-0.4]  31.52 4.57 0 top
R11  1.5k  [R_AXIAL-0.4]  43.46 7.49 270 top
R12  10kΩ  [R_AXIAL-0.4]  19.46 44.44 180 top
R13  22k  [R_AXIAL-0.4]  48.03 12.82 90 top
R14  22k  [R_AXIAL-0.4]  50.57 12.82 90 top
R15  470  [R_AXIAL-0.4]  67.46 6.85 270 top
U1  Raspberry Pi Zero Hat Template  [RASPBERRY_PI_ZERO_HAT]  4.72 43.68 0 top
U2  SN74LVC245ANG4  [PDIP-20_L25.9-W6.6-P2.54-LS7.9-BL]  24.66 25.39 0 top
U3  SN74LVC245ANG4  [PDIP-20_L25.9-W6.6-P2.54-LS7.9-BL]  58.19 25.39 0 top

## Footprints (pads in the part's own frame, mm; a bottom-side part is the same pattern mirrored in y, then rotated)
CAP-TH_BD8.0-P3.50-D0.6-FD_1
  round 1.6 hole 1: 1(-1.75,0) 2(1.75,0)
HDR-TH_2P-P2.54-V-F
  rect 1.7x1.7 hole 1: 1(-1.27,0)
  round 1.7 hole 1: 2(1.27,0)
HDR-TH_3P-P2.54-V-F
  rect 1.575x1.575 hole 1.02: 1(-2.54,0)
  round 1.575 hole 1.02: 2(0,0) 3(2.54,0)
HDR-TH_8P-P2.54-V-F-1
  rect 1.8x1.8 hole 1.2: 1(-8.89,0)
  round 1.8 hole 1.2: 2(-6.35,0) 3(-3.81,0) 4(-1.27,0) 5(1.27,0) 6(3.81,0) 7(6.35,0) 8(8.89,0)
HDR-TH_10P-P2.54-V-F
  rect 1.575x1.7 hole 1.1: 1(-11.43,0)
  round 1.7 hole 1.1: 2(-8.89,0) 3(-6.35,0) 4(-3.81,0) 5(-1.27,0) 6(1.27,0) 7(3.81,0) 8(6.35,0) 9(8.89,0) 10(11.43,0)
PDIP-20_L25.9-W6.6-P2.54-LS7.9-BL
  oval 1.462x1.827 hole 0.8: 1(-11.43,-3.97) 2(-8.89,-3.97) 3(-6.35,-3.97) 4(-3.81,-3.97) 5(-1.27,-3.97) 6(1.27,-3.97) 7(3.81,-3.97) 8(6.35,-3.97) 9(8.89,-3.97) 10(11.43,-3.97) 11(11.43,3.97) 12(8.89,3.97) 13(6.35,3.97) 14(3.81,3.97) 15(1.27,3.97) 16(-1.27,3.97) 17(-3.81,3.97) 18(-6.35,3.97) 19(-8.89,3.97) 20(-11.43,3.97)
R_AXIAL-0.4
  round 1.879 hole 0.899: 1(-5.08,0) 2(5.08,0)
RASPBERRY_PI_ZERO_HAT
  rect 1.7x1.7 hole 1: 1(8.37,-4.78)
  round 1.7 hole 1: 2(8.37,-2.24) 3(10.91,-4.78) 4(10.91,-2.24) 5(13.45,-4.78) 6(13.45,-2.24) 7(15.99,-4.78) 8(15.99,-2.24) 9(18.53,-4.78) 10(18.53,-2.24) 11(21.07,-4.78) 12(21.07,-2.24) 13(23.61,-4.78) 14(23.61,-2.24) 15(26.15,-4.78) 16(26.15,-2.24) 17(28.69,-4.78) 18(28.69,-2.24) 19(31.23,-4.78) 20(31.23,-2.24) 21(33.77,-4.78) 22(33.77,-2.24) 23(36.31,-4.78) 24(36.31,-2.24) 25(38.85,-4.78) 26(38.85,-2.24) 27(41.39,-4.78) 28(41.39,-2.24) 29(43.93,-4.78) 30(43.93,-2.24) 31(46.47,-4.78) 32(46.47,-2.24) 33(49.01,-4.78) 34(49.01,-2.24) 35(51.55,-4.78) 36(51.55,-2.24) 37(54.09,-4.78) 38(54.09,-2.24) 39(56.63,-4.78) 40(56.63,-2.24)
TO-92-3_L4.8-W3.7-P1.27-L-1
  rect 1.05x1.6 hole 0.75: 1(-1.27,0)
  oval 1.05x1.6 hole 0.75: 2(0,0) 3(1.27,0)
TO-92-3_L4.8-W3.7-P2.54-R
  rect 1.8x1.8 hole 1: 1(2.54,0)
  round 1.8 hole 1: 2(0,0) 3(-2.54,0)

## Nets
As in the schematic.

Pads without a net: U1 3 4 5 7 9 10 11 13 14 15 17 20 21 25 26 27 28 30 33 34 35 36 39

## Via types
v1: diameter 0.61, hole 0.305, Top Layer to Bottom Layer, 26 vias

## Routing (per net, layer and track width the routed paths; a pad name or vN(x,y) marks a point on that pad's centre or on a via; arc(x,y) is an arc through that point)
5V: length 52.6
  Top Layer w1.5: H5.1 13.23,16.25 9.3,12.31 7.14,12.31 3.71,15.74 3.71,42.16 6.12,44.57 9.92,44.57 13.09,41.39
VCC: length 147
  Top Layer w0.25: 13.09,38.9 14.38,40.18 R12.2
  Top Layer w0.5: R13.1 49.68,6.09 51.46,6.09 R6.2 61.59,7.74 61.62,7.71 71.75,7.71 71.78,7.74 ; H10.1 67.72,35.43 31.9,35.43 ; R4.2 10.98,31.62 U2.20 13.23,38.76 ; U3.20 46.67,29.46 R5.1 39.52,33.14 H9.1 33.55,33.78 31.9,35.43 ; 31.9,35.43 16.57,35.43 13.23,38.76 ; 13.23,38.76 13.09,38.9
  Bottom Layer w0.5: R13.1 45.11,10.66 45.11,21.2 43.21,23.11 R5.1
A0-A: length 43.1
  Top Layer w0.15: v1(59.46,26) 59.44,26.03 29.78,26.03 26.44,29.36 U2.15 25.93,30.6 H9.5
  Bottom Layer w0.15: U3.15 v1(59.46,26)
A0-B: length 46.5
  Top Layer w0.15: H10.5 61.37,31.62 67.37,31.62 U3.11 69.62,29.24 68.45,28.06 37.27,28.06 36.09,29.24 U2.11
CE-A: length 46
  Top Layer w0.15: v1(56.92,25.47) 28.29,25.47 24.4,29.36 U2.16
  Bottom Layer w0.15: U2.16 25.01,30.98 26.95,30.98 28.47,32.51 H9.3 ; U3.16 v1(56.92,25.47)
CE-B: length 41.2
  Top Layer w0.15: v1(67.08,27.53) 67.06,27.55 35.36,27.55 U2.12
  Bottom Layer w0.15: H10.3 67.08,30.98 U3.12 v1(67.08,27.53)
DISPLAY_D/C: length 15.3
  Top Layer w0.15: U2.9 33.55,22.71 v1(33.57,22.73)
  Top Layer w0.25: U2.5 H5.5
  Bottom Layer w0.15: v1(33.57,22.73) 24.7,22.73 U2.5
DISPLAY_LIGHT: length 29.3
  Bottom Layer w0.15: H5.6 25.93,14.98 Q2.1 30.89,4.31 32.79,2.41 R9.1 R11.2
DISPLAY_SPI_CE: length 16.1
  Top Layer w0.15: U2.8 v1(31.01,23.31)
  Top Layer w0.25: U2.4 H5.4
  Bottom Layer w0.15: U2.4 20.95,21.42 22.76,23.23 30.94,23.23 v1(31.01,23.31)
DISPLAY_SPI_SCK: length 18.1
  Top Layer w0.15: U2.6 v1(25.93,24.33)
  Top Layer w0.25: U2.2 H5.2
  Bottom Layer w0.15: U2.2 15.77,22.47 17.55,24.25 25.86,24.25 v1(25.93,24.33)
DISPLAY_SPI_SDA: length 16.6
  Top Layer w0.15: U2.7 v1(28.47,23.77)
  Top Layer w0.25: U2.3 H5.3
  Bottom Layer w0.15: v1(28.47,23.77) 28.45,23.74 20.76,23.74 18.44,21.42
LED: length 91.8
  Top Layer w0.25: v1(70.13,36.82) v1(51.97,36.82) 51.95,36.84 17.7,36.84 v1(17.68,36.82)
  Top Layer w0.35: v1(74.07,36.82) 74.07,16.25 71.78,13.96 71.78,10.28
  Bottom Layer w0.15: v1(51.97,36.82) 51.97,33.39
  Bottom Layer w0.25: v1(70.13,36.82) v1(74.07,36.82) ; H9.8 15.77,34.92 v1(17.68,36.82)
RESET: length 63.2
  Top Layer w0.25: v1(24.54,47.11) v1(57.56,47.11)
  Bottom Layer w0.15: H9.4 24.54,34.54 R12.1 v1(24.54,47.11) ; H10.4 62.13,35.54 57.56,40.11 v1(57.56,47.11)
SCK-A: length 44.5
  Top Layer w0.15: H9.7 U2.18 18.31,28.98 20.63,26.66 25.51,26.66 27.75,24.43 51.32,24.43 51.33,24.41 v1(51.84,24.41)
  Bottom Layer w0.15: U3.18 v1(51.84,24.41)
SCK-B: length 46.9
  Top Layer w0.15: U2.14 31.3,26.54 61.98,26.54 v1(62,26.51) ; H10.7 57.18,30.73 60.99,30.73 62,29.71 U3.14
  Bottom Layer w0.15: U3.14 v1(62,26.51)
SDA-A: length 43.7
  Top Layer w0.15: H9.6 U2.17 20.85,29.11 22.92,27.05 25.81,27.05 27.91,24.94 v1(54.38,24.94)
  Bottom Layer w0.15: U3.17 v1(54.38,24.94)
SDA-B: length 46
  Top Layer w0.15: H10.6 59.33,31.11 62.76,31.11 64.51,29.36 U3.13 ; U2.13 33.33,27.05 64.49,27.05 v1(64.54,27)
  Bottom Layer w0.15: U3.13 v1(64.54,27)
SOUND_PULSE: length 6.6
  Top Layer w0.15: R7.1 34.7,19.3 H5.9
SYNC: length 83.8
  Top Layer w0.25: v1(38.51,46.53) 6.17,46.53 2.57,42.92 2.57,14.85 6.76,10.66 H8.3
  Bottom Layer w0.15: 38.49,41.39 38.51,41.41 v1(38.51,46.53)
UART: length 6.3
  Top Layer w0.15: H8.2 H6.1
UART_RX: length 12.3
  Top Layer w0.15: H6.2 28.47,13.71 H5.7
UART_TX: length 17.6
  Top Layer w0.15: H7.1 20.98,10.66 24.66,14.34 24.66,18.79 25.53,19.66 29.51,19.66 H5.8
$1N1683: length 20.9
  Bottom Layer w0.15: 41.03,38.85 45.11,34.78 45.11,25.61 U3.2
$1N1689: length 28.6
  Top Layer w0.15: v1(44.92,37.65) 44.86,37.71 37.1,37.71 35.95,38.85
  Bottom Layer w0.15: v1(44.92,37.65) 45.05,37.65 48.03,34.67 48.03,25.23 U3.3
$1N1695: length 87.6
  Top Layer w0.15: v1(41.05,45.97) 68.35,45.97 73.43,40.89 73.43,16.5 70.13,13.2 64.03,13.2 57.3,19.93 55.4,19.93 54.38,20.95 U3.4
  Bottom Layer w0.15: 41.03,41.39 41.05,41.41 v1(41.05,45.97)
$1N1701: length 90.5
  Top Layer w0.15: U3.5 56.92,20.82 64.16,13.58 70,13.58 73.05,16.63 73.05,40.63 68.35,45.33 v1(33.43,45.33)
  Bottom Layer w0.15: 33.41,41.39 33.43,41.41 v1(33.43,45.33)
$1N1733: length 41.1
  Top Layer w0.15: 61.35,41.39 63.39,43.43 68.22,43.43 71.53,40.13 71.53,27.93 70.13,26.54 65.56,26.54 64.29,25.27 60.35,25.27 59.46,24.38 U3.6
$1N1755: length 42.5
  Top Layer w0.15: 58.81,41.39 58.81,41.51 61.11,43.81 68.35,43.81 71.91,40.25 71.91,27.81 70.26,26.16 65.81,26.16 64.41,24.76 62.13,24.76 62,24.63 U3.7
$1N1761: length 73.9
  Top Layer w0.15: U3.8 64.54,24.25 66.07,25.78 70.38,25.78 72.29,27.68 72.29,40.38 68.48,44.19 28.59,44.19 25.79,41.39
$1N1789: length 49.2
  Top Layer w0.15: v1(51.21,44.72) 68.45,44.72 72.67,40.51 72.67,27.55 70.51,25.39 68.35,25.39 67.08,24.12 U3.9
  Bottom Layer w0.15: v1(51.21,44.72) 51.21,41.41 51.19,41.39
$1N1944: length 5.1
  Top Layer w0.25: U2.1 8.19,21.42 R4.1
$1N1977: length 4.4
  Top Layer w0.25: U3.1 45.33,21.42 R5.2
$1N2168: length 26.5
  Bottom Layer w0.15: R6.1 53.11,22.09 52.6,22.6 51.59,22.6 49.3,24.89 U3.19 49.3,36.96 51.19,38.85
  Bottom Layer w0.25: R14.2 R6.1
$1N2174: length 118.9
  Top Layer w0.25: R13.2 50.57,15.36 Q4.3 ; v1(59.59,1.14) 13.61,1.14 0.66,14.09 v1(0.66,27.68)
  Bottom Layer w0.15: v1(0.66,27.68) 14.09,27.68 U2.19
  Bottom Layer w0.25: Q4.3 59.59,12.57 v1(59.59,1.14)
$1N2477: length 78.2
  Top Layer w0.25: 22.89,10.53 21.74,9.39 7.14,9.39 1.93,14.6 1.93,43.05 5.87,46.98 20.6,46.98 v1(20.73,47.11)
  Bottom Layer w0.15: 20.71,41.39 20.73,41.41 v1(20.73,47.11)
$1N2537: length 15.6
  Bottom Layer w0.15: 30.87,41.39 32.16,40.11 32.16,38.09 39.65,30.6 R7.2
$1N3217: length 42.2
  Top Layer w0.15: 36.47,15.11 30.89,15.11
  Top Layer w0.25: 67.72,11.93 62.64,11.93 54.51,20.06 47.27,20.06 42.32,15.11 36.47,15.11
$1N3257: length 135.4
  Top Layer w0.15: R10.2 R8.1 36.6,9.27
  Top Layer w0.25: v1(49.94,47.75) 49.88,47.69 5.56,47.69 1.3,43.43 1.3,14.34 13.87,1.77 33.93,1.77 36.6,4.44 R10.2
  Bottom Layer w0.15: 48.65,38.85 48.67,38.85 49.94,40.13 v1(49.94,47.75)
$1N3259: length 7
  Top Layer w0.15: R8.2 26.44,8.12 Q2.2
$1N3309: length 4.2
  Top Layer w0.15: Q1.2 R9.2
$1N5387: length 10.2
  Top Layer w0.25: Q4.2 52.48,12.82 50.57,10.92 R14.1
$1N5983: length 9
  Bottom Layer w0.25: Q3.2 71.06,8.54 70.92,8.54 67.46,5.09 R15.2

## Copper pours and planes (outline as drawn; the poured copper is in the pictures)
GND on Bottom Layer: -2.01,51.05 75.84,51.05 75.84,-2.42 -2.01,-2.42
GND on Bottom Layer: -3.53,52.83 77.11,52.83 77.11,-4.2 -3.53,-4.2

## Text on the board
Top Silkscreen Layer: LIGHT BOARD | SCREEN_A | -CONFIG- / BOXI 1: L+R / BOXI 2: BTM | SCREEN_B | BOXI2BUS | 2025 | by CREME & FOXPAW | OwO | BOXI PI HAT

# Board Audio Mixer
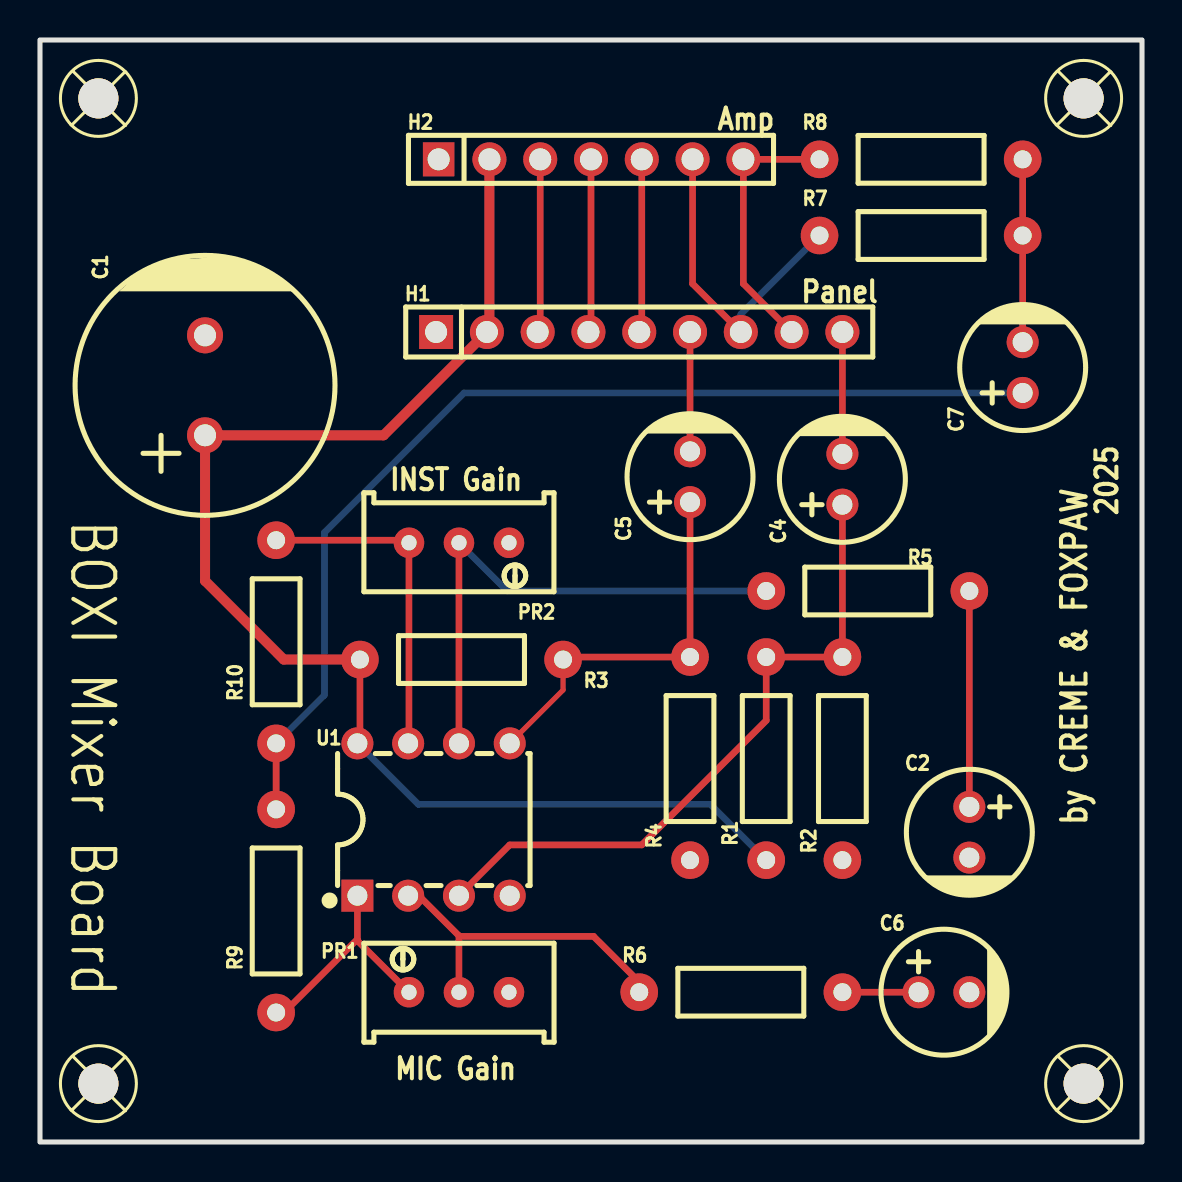
[diagram p7: board, top side]
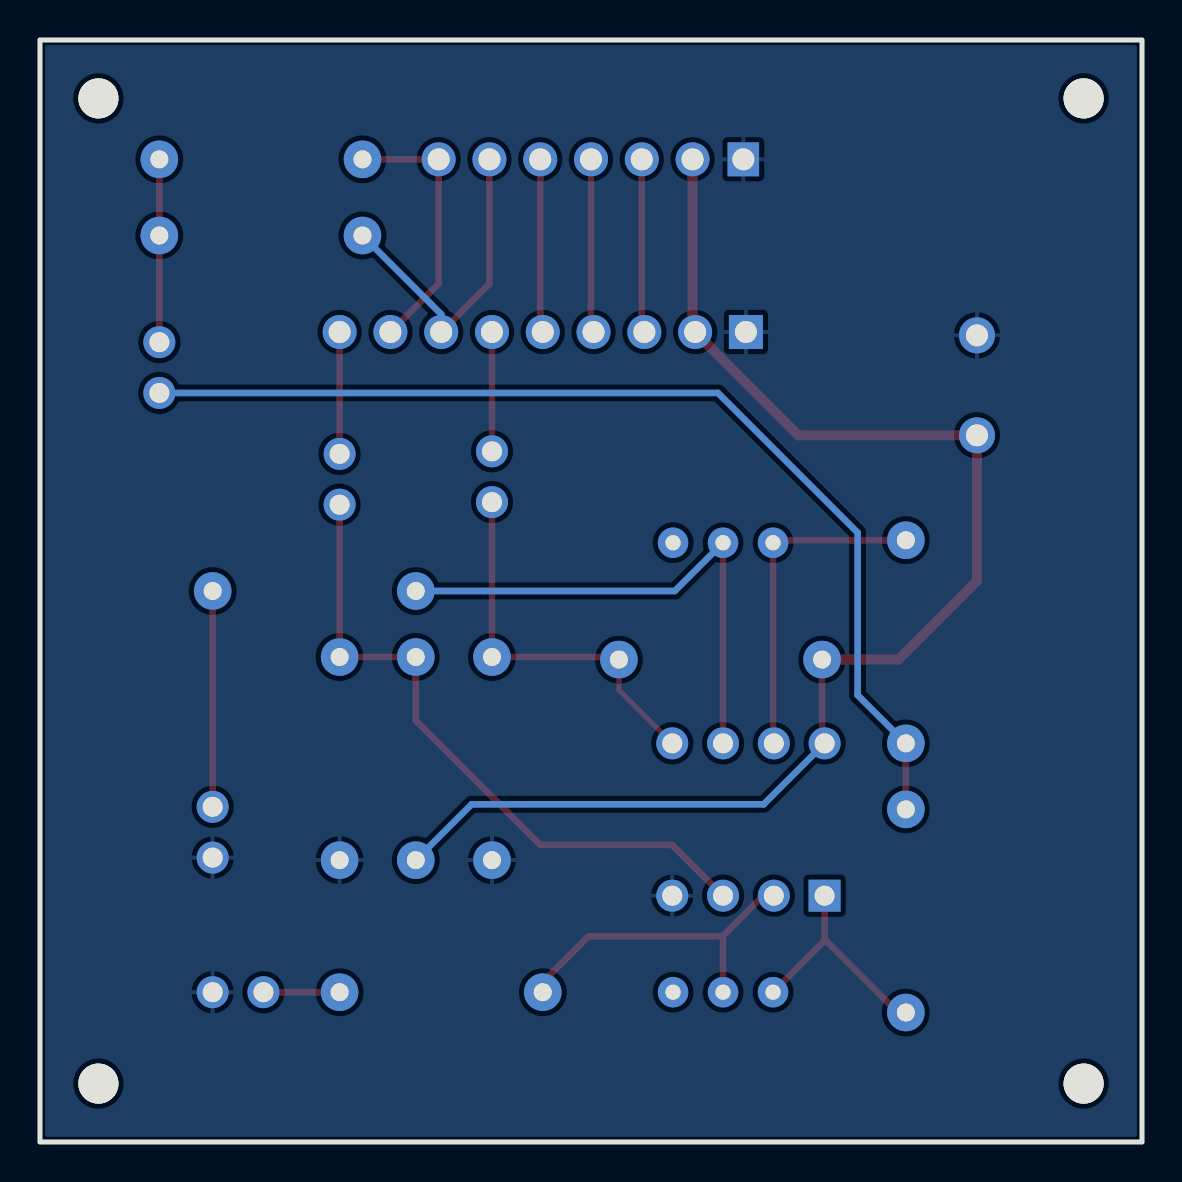
[diagram p8: board, bottom side, seen from below]

Outline 55.12 x 55.12 mm; copper layers: Top Layer, Bottom Layer. Coordinates in mm from the lower left corner of the outline.
Outline path: rectangle 0,55.12 55.12,0
Stack: Top Layer 0.035mm / Dielectric1 1.51mm FR4 er 4.5 / Bottom Layer 0.035mm

## Design rules (mm)
template: JLCPCB Capability(Two Layers Board)
spacing copperThickness1oz (default): track to track 0.102, other pairs 0.152 to 0.3
spacing copperThickness2oz: track to track 0.203, other pairs 0.152 to 0.3
track width copperThickness1oz (default): min 0.127, default 0.254, max 2.54
track width copperThickness2oz: min 0.203, default 0.254, max 2.54
differential pair differentialPair (default): width min 0.127, default 0.254, max 2.54; gap min 0.152, default 0.152
via viaSize (default): diameter min 0.5, default 0.61, max 10; hole min 0.3, default 0.305, max 6.3

## Placement (name value [footprint] x y rotation side)
C1  470uF  [CAP-TH_BD13.0-P5.00-D0.6-FD]  8.25 37.85 90 top
C2  22uF  [CAP-TH_BD6.3-P2.50-D1.0-FD]  46.48 15.49 270 top
C4  22uF  [CAP-TH_BD6.3-P2.50-D1.0-FD]  40.13 33.15 90 top
C5  22uF  [CAP-TH_BD6.3-P2.50-D1.0-FD]  32.51 33.27 90 top
C6  22uF  [CAP-TH_BD6.3-P2.50-D1.0-FD]  45.21 7.49 0 top
C7  22uF  [CAP-TH_BD6.3-P2.50-D1.0-FD]  49.15 38.73 90 top
H1  -  [HDR-TH_9P-P2.54-V-F-1]  29.97 40.51 0 top
H2  -  [HDR-TH_7P-P2.54-V-F]  27.56 49.15 0 top
PR1  50k  [RES-ADJ-TH_3P-L10.0-W10.0-P2.50-L]  20.96 7.49 0 top
PR2  50k  [RES-ADJ-TH_3P-L10.0-W10.0-P2.50-L]  20.96 29.97 180 top
R1  10kΩ  [R_AXIAL-0.4]  36.32 19.18 270 top
R2  10kΩ  [R_AXIAL-0.4]  40.13 19.18 90 top
R3  10kΩ  [R_AXIAL-0.4]  21.08 24.13 180 top
R4  10kΩ  [R_AXIAL-0.4]  32.51 19.18 90 top
R5  1k  [R_AXIAL-0.4]  41.4 27.56 0 top
R6  1k  [R_AXIAL-0.4]  35.05 7.49 0 top
R7  4.7k  [R_AXIAL-0.4]  44.07 45.34 0 top
R8  4.7k  [R_AXIAL-0.4]  44.07 49.15 0 top
R9  1k  [R_AXIAL-0.4]  11.81 11.56 90 top
R10  1k  [R_AXIAL-0.4]  11.81 25.02 90 top
SCREW1  -  [Screw-Hole-M2]  2.92 52.2 0 top
SCREW2  -  [Screw-Hole-M2]  2.92 2.92 0 top
SCREW4  -  [Screw-Hole-M2]  52.2 52.2 0 top
SCREW4#2  -  [Screw-Hole-M2]  52.2 2.92 0 top
U1  TLV2462AIP  [PDIP-8_L9.6-W6.4-P2.54-LS7.9-BL]  19.69 16.13 0 top

## Footprints (pads in the part's own frame, mm; a bottom-side part is the same pattern mirrored in y, then rotated)
CAP-TH_BD6.3-P2.50-D1.0-FD
  round 1.6 hole 1: 1(-1.27,0) 2(1.27,0)
CAP-TH_BD13.0-P5.00-D0.6-FD
  round 1.8 hole 1.1: 1(-2.5,0) 2(2.5,0)
HDR-TH_7P-P2.54-V-F
  rect 1.575x1.7 hole 1.1: 1(-7.62,0)
  round 1.7 hole 1.1: 2(-5.08,0) 3(-2.54,0) 4(0,0) 5(2.54,0) 6(5.08,0) 7(7.62,0)
HDR-TH_9P-P2.54-V-F-1
  rect 1.7x1.7 hole 1.1: 1(-10.16,0)
  round 1.7 hole 1.1: 2(-7.62,0) 3(-5.08,0) 4(-2.54,0) 5(0,0) 6(2.54,0) 7(5.08,0) 8(7.62,0) 9(10.16,0)
PDIP-8_L9.6-W6.4-P2.54-LS7.9-BL
  rect 1.6x1.6 hole 1: 1(-3.81,-3.81)
  round 1.6 hole 1: 2(-1.27,-3.81) 3(1.27,-3.81) 4(3.81,-3.81) 5(3.81,3.81) 6(1.27,3.81) 7(-1.27,3.81) 8(-3.81,3.81)
R_AXIAL-0.4
  round 1.879 hole 0.899: 1(-5.08,0) 2(5.08,0)
RES-ADJ-TH_3P-L10.0-W10.0-P2.50-L
  round 1.524 hole 0.762: 1(-2.5,0) 2(0,0) 3(2.5,0)
Screw-Hole-M2
  round 2 hole 2: 1(0,0)

## Nets
As in the schematic.

Pads without a net: PR1 3; PR2 1; SCREW1 1; SCREW2 1; SCREW4 1; SCREW4#2 1

## Routing (per net, layer and track width the routed paths; a pad name or vN(x,y) marks a point on that pad's centre or on a via; arc(x,y) is an arc through that point)
VCC: length 68.7
  Top Layer w0.33: U1.8 16,20.07 R3.2
  Top Layer w0.5: R3.2 12.19,24.13 8.25,28.07 C1.1 17.19,35.35 H1.2 22.48,40.64 H2.2
  Bottom Layer w0.33: R1.2 33.53,16.89 18.92,16.89 U1.8
INPUT_INSTR: length 6
  Top Layer w0.33: H1.6 C5.2
INPUT_LINE_L: length 16.1
  Top Layer w0.33: H2.6 32.64,42.93 H1.7
  Bottom Layer w0.33: H1.7 35.05,41.4 38.99,45.34
INPUT_LINE_R: length 13.4
  Top Layer w0.33: 38.99,49.15 H2.7 35.18,42.93 H1.8
INPUT_MIC: length 6.1
  Top Layer w0.33: H1.9 40.13,34.42
POT_BASS: length 8.7
  Top Layer w0.33: H2.4 27.56,40.64 H1.4
POT_SENSITIVITY: length 8.7
  Top Layer w0.33: H2.5 30.1,40.64 H1.5
POT_VOLUME: length 8.7
  Top Layer w0.33: H2.3 25.02,40.64 H1.3
$1N770: length 33.6
  Top Layer w0.33: U1.3 23.5,14.86 30.1,14.86 36.32,21.08 R1.1 R2.2 C4.1
$1N1061: length 16.7
  Top Layer w0.33: U1.7 18.46,19.98 PR2.3 18.33,30.1 R10.2
$1N1293: length 19.4
  Top Layer w0.254: U1.5 26.16,22.61 R3.1
  Top Layer w0.33: C5.1 R4.2 26.29,24.26 R3.1
$1N1394: length 10.8
  Top Layer w0.33: R5.2 C2.1
$1N1446: length 3.8
  Top Layer w0.33: R6.2 C6.1
$1N1450: length 16.7
  Top Layer w0.33: R6.1 29.97,8 27.69,10.29 20.98,10.29 20.96,10.32 ; U1.2 18.95,12.32 20.96,10.32 ; 20.96,10.32 PR1.2
$1N1454: length 26.4
  Top Layer w0.33: PR2.2 U1.6
  Bottom Layer w0.33: PR2.2 23.37,27.56 R5.1
$1N1584: length 11.5
  Top Layer w0.33: PR1.1 15.88,10.07 15.88,10.14 ; 15.88,10.14 12.21,6.48 11.81,6.48 ; 15.88,10.14 U1.1
$1N2116: length 9.1
  Top Layer w0.33: C7.2 R7.2 R8.2
$1N2130: length 52.7
  Top Layer w0.33: R10.1 11.81,16.64
  Bottom Layer w0.33: R10.1 14.22,22.35 14.22,30.48 21.21,37.46 C7.1

## Copper pours and planes (outline as drawn; the poured copper is in the pictures)
GND on Bottom Layer: -2.92,57.53 56.9,57.53 56.9,-1.27 -2.92,-1.27

## Text on the board
Top Silkscreen Layer: INST Gain | MIC Gain | Amp | Panel | 2025 | by CREME & FOXPAW | BOXI Mixer Board
